# Altium project mb1045.PrjPCB
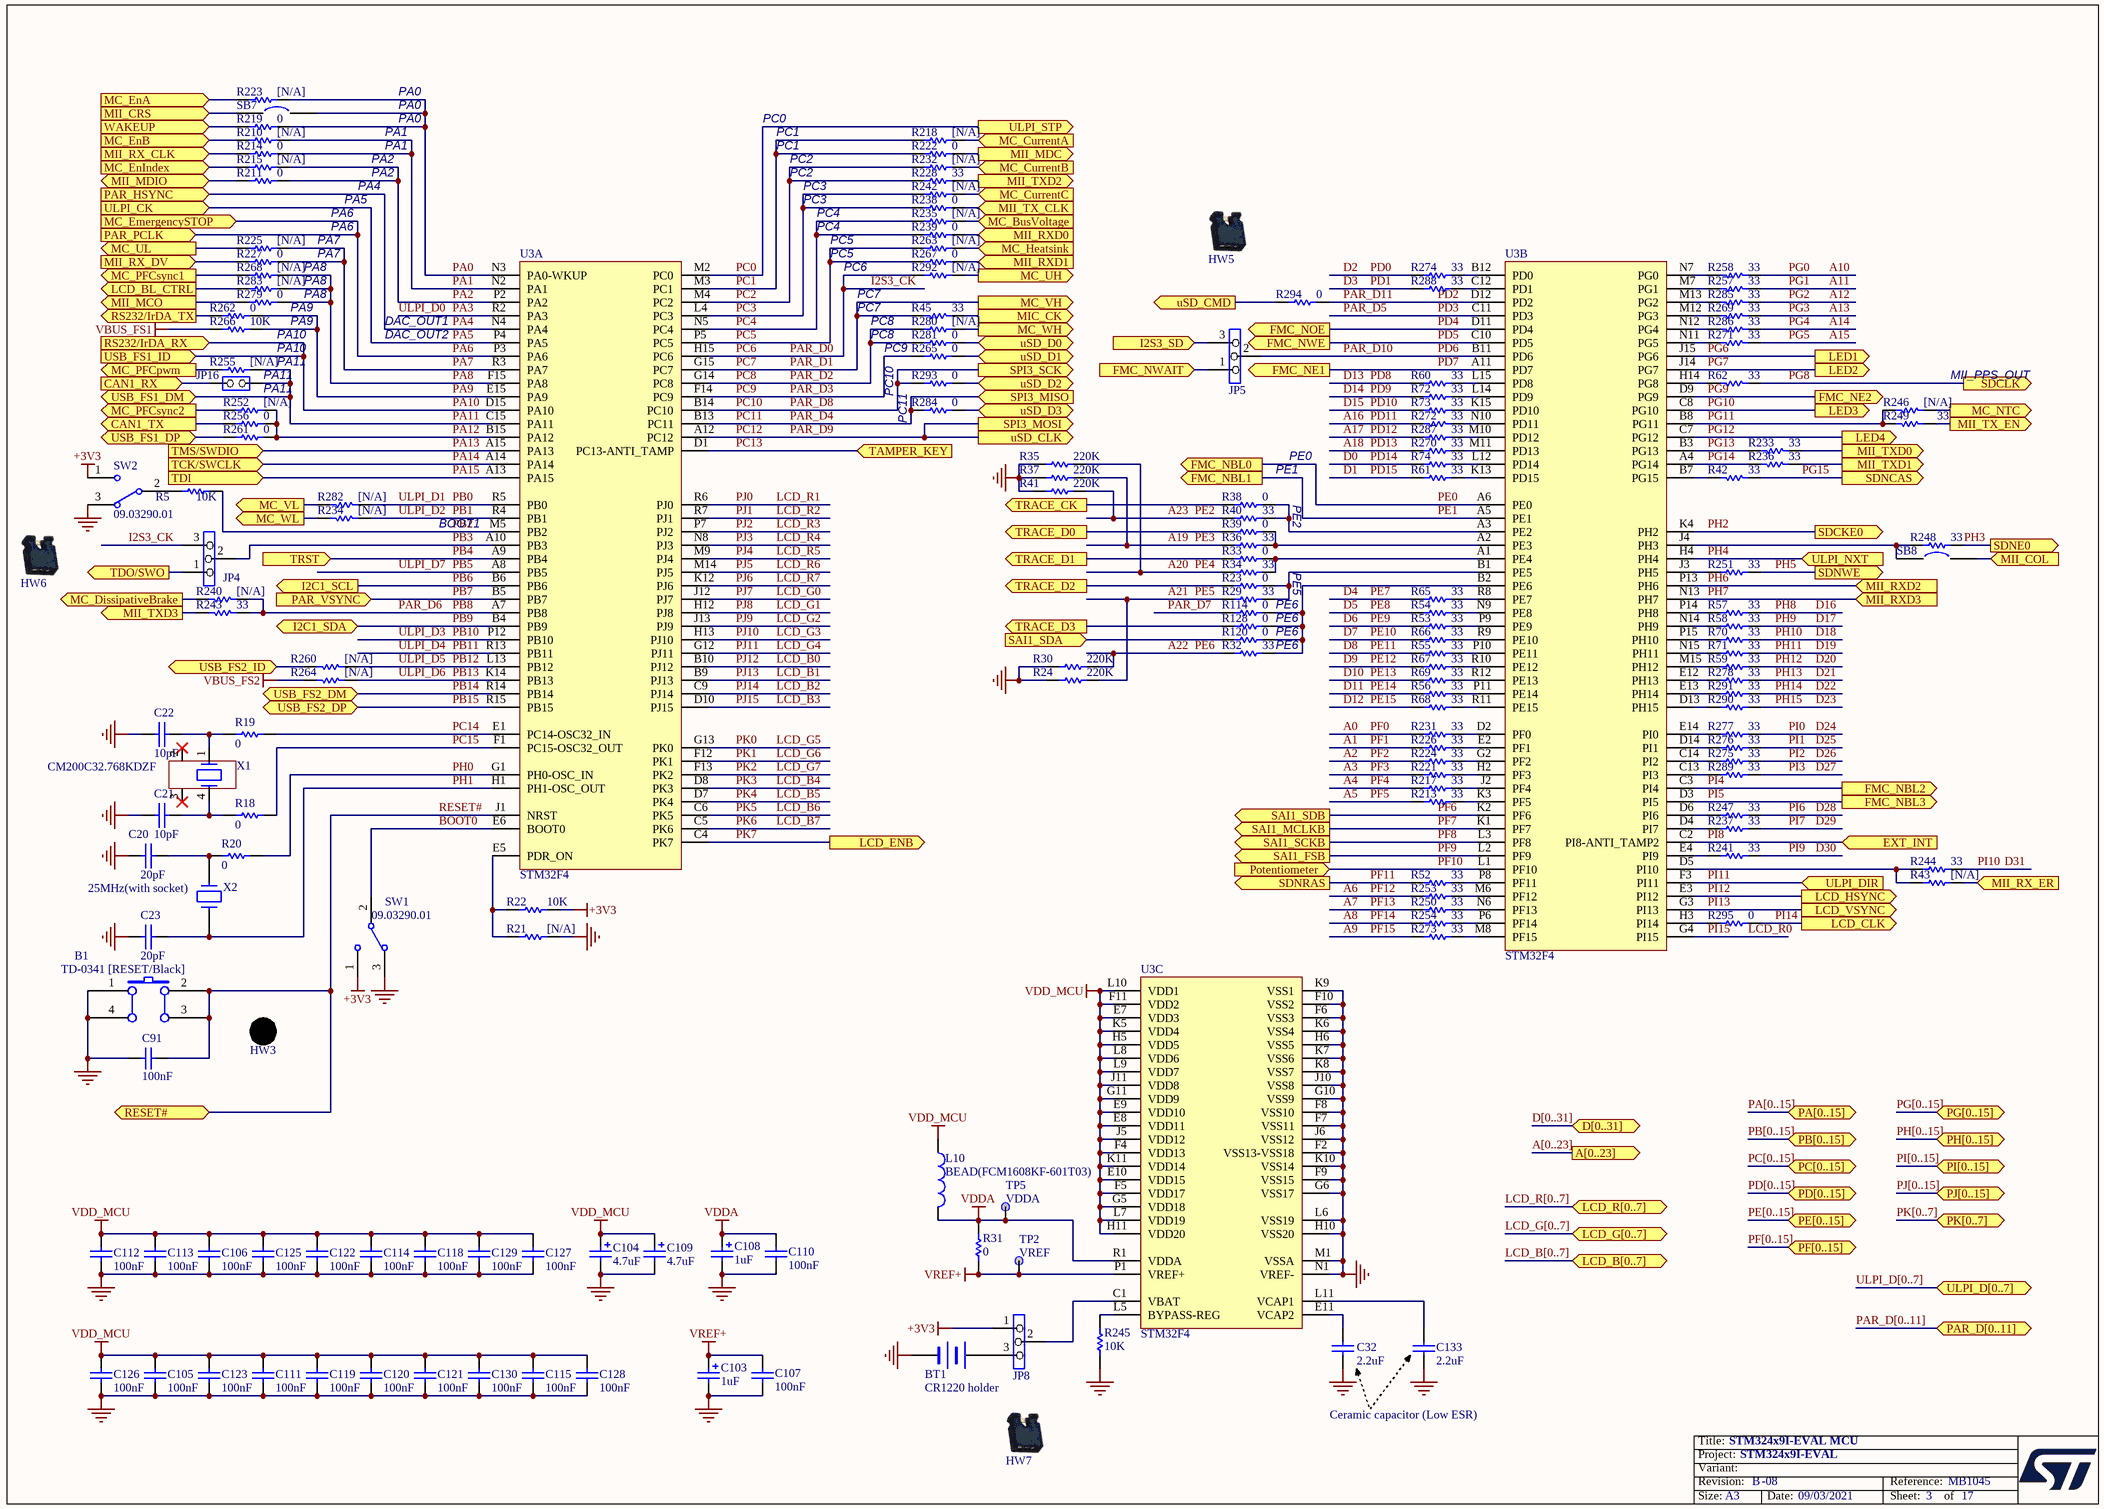
[diagram p0: MCU.SchDoc]
Board_Reference: MB1045; Board_PCB_Revision: B; Board_Name: STM324x9I-EVAL; Board_Document_Date: 09/03/2021; Board_Assembly_revision: 08
6 sheets, 346 parts. Net scope: flat (ports and power ports of the same name join across sheets).
Sheets:
  MCU.SchDoc
  Ethernet.SchDoc
  USB_OTG.SchDoc
  RS232&IrDA.SchDoc
  CAN&MicroSDD&IO_Expandor.SchDoc
  MotorControl.SchDoc

## Sheet MCU.SchDoc: STM324x9I-EVAL MCU
size A3; DocumentNumber: 3; Revision: B.3; SheetNumber: 3; SheetTotal: 17

### Parts
B1  TD-0341 [RESET/Black]  [PB10]
BT1  CR1220 holder  [BAT_2SM_CR1220]
C20  20pF  [0603C]
C21  10pF  [0603C]
C22  10pF  [0603C]
C23  20pF  [0603C]
C32  2.2uF  [1206C]
C91  100nF  [0603C]
C103  1uF  [TAN-A]
C104  4.7uF  [TAN-A]
C105  100nF  [0402C]
C106  100nF  [0402C]
C107  100nF  [0402C]
C108  1uF  [TAN-A]
C109  4.7uF  [TAN-A]
C110  100nF  [0402C]
C111  100nF  [0402C]
C112  100nF  [0402C]
C113  100nF  [0402C]
C114  100nF  [0402C]
C115  100nF  [0402C]
C118  100nF  [0402C]
C119  100nF  [0402C]
C120  100nF  [0402C]
C121  100nF  [0402C]
C122  100nF  [0402C]
C123  100nF  [0402C]
C125  100nF  [0402C]
C126  100nF  [0402C]
C127  100nF  [0402C]
C128  100nF  [0402C]
C129  100nF  [0402C]
C130  100nF  [0402C]
C133  2.2uF  [1206C]
HW3  BUTTON_HAT_BLACK  (value not drawn)  (mechanical)
HW5  JUMPER_OPEN  (value not drawn)
HW6  JUMPER_OPEN  (value not drawn)
HW7  JUMPER_OPEN  (value not drawn)
JP4  (no value)  [SIP3]
JP5  (no value)  [SIP3]
JP8  (no value)  [SIP3]
JP16  (no value)  [SIP2]
L10  BEAD(FCM1608KF-601T03)  [0603L]
R5  10K  [0603R]
R18  0  [0603R]
R19  0  [0603R]
R20  0  [0603R]
R21  [N/A]  [0603R]
R22  10K  [0603R]
R23  0  [0603R]
R24  220K  [0603R]
R29  33  [0402R]
R30  220K  [0603R]
R31  0  [0603R]
R32  33  [0402R]
R33  0  [0603R]
R34  33  [0402R]
R35  220K  [0603R]
R36  33  [0402R]
R37  220K  [0603R]
R38  0  [0603R]
R39  0  [0603R]
R40  33  [0402R]
R41  220K  [0603R]
R42  33  [0402R]
R43  [N/A]  [0603R]
R45  33  [0603R]
R52  33  [0402R]
R53  33  [0402R]
R54  33  [0402R]
R55  33  [0402R]
R56  33  [0402R]
R57  33  [0402R]
R58  33  [0402R]
R59  33  [0402R]
R60  33  [0402R]
R61  33  [0402R]
R62  33  [0402R]
R65  33  [0402R]
R66  33  [0402R]
R67  33  [0402R]
R68  33  [0402R]
R69  33  [0402R]
R70  33  [0402R]
R71  33  [0402R]
R72  33  [0402R]
R73  33  [0402R]
R74  33  [0402R]
R114  0  [0603R]
R120  0  [0603R]
R128  0  [0603R]
R210  [N/A]  [0603R]
R211  0  [0603R]
R213  33  [0402R]
R214  0  [0603R]
R215  [N/A]  [0603R]
R217  33  [0402R]
R218  [N/A]  [0603R]
R219  0  [0603R]
R221  33  [0402R]
R222  0  [0603R]
R223  [N/A]  [0603R]
R224  33  [0402R]
R225  [N/A]  [0603R]
R226  33  [0402R]
R227  0  [0603R]
R228  33  [0603R]
R231  33  [0402R]
R232  [N/A]  [0603R]
R233  33  [0603R]
R234  [N/A]  [0603R]
R235  [N/A]  [0603R]
R236  33  [0603R]
R237  33  [0402R]
R238  0  [0603R]
R239  0  [0603R]
R240  [N/A]  [0603R]
R241  33  [0402R]
R242  [N/A]  [0603R]
R243  33  [0603R]
R244  33  [0402R]
R245  10K  [0603R]
R246  [N/A]  [0603R]
R247  33  [0402R]
R248  33  [0402R]
R249  33  [0603R]
R250  33  [0402R]
R251  33  [0402R]
R252  [N/A]  [0603R]
R253  33  [0402R]
R254  33  [0402R]
R255  [N/A]  [0603R]
R256  0  [0603R]
R257  33  [0402R]
R258  33  [0402R]
R260  [N/A]  [0603R]
R261  0  [0603R]
R262  0  [0603R]
R263  [N/A]  [0603R]
R264  [N/A]  [0603R]
R265  0  [0603R]
R266  10K  [0603R]
R267  0  [0603R]
R268  [N/A]  [0603R]
R269  33  [0402R]
R270  33  [0402R]
R271  33  [0402R]
R272  33  [0402R]
R273  33  [0402R]
R274  33  [0402R]
R275  33  [0402R]
R276  33  [0402R]
R277  33  [0402R]
R278  33  [0402R]
R279  0  [0603R]
R280  [N/A]  [0603R]
R281  0  [0603R]
R282  [N/A]  [0603R]
R283  [N/A]  [0603R]
R284  0  [0603R]
R285  33  [0402R]
R286  33  [0402R]
R287  33  [0402R]
R288  33  [0402R]
R289  33  [0402R]
R290  33  [0402R]
R291  33  [0402R]
R292  [N/A]  [0603R]
R293  0  [0603R]
R294  0  [0603R]
R295  0  [0603R]
SB7  (no value)  [JP2_SMD]
SB8  (no value)  [JP2_SMD]
SW1  09.03290.01  [SW1_3TH_2R54_10X2R5]
SW2  09.03290.01  [SW1_3TH_2R54_10X2R5]
TP2  VREF  [TP]
TP5  VDDA  [TP]
U3  STM32F4  [BGA216_0R8_13X13_SKT]  (parts A,B,C of 3)
X1  CM200C32.768KDZF  [XTAL_4SM_8X3R8]
X2  25MHz(with socket)  [XTAL_socket]

### Ports
A[0..23] (out), CAN1_RX (in), CAN1_TX (out), D[0..31] (bidir), EXT_INT (in), FMC_NBL0 (out), FMC_NBL1 (out), FMC_NBL2 (out), FMC_NBL3 (out), FMC_NE1 (out), FMC_NE2 (out), FMC_NOE (out), FMC_NWAIT (in), FMC_NWE (out), I2C1_SCL (out), I2C1_SDA (bidir), I2S3_SD (in), LCD_B[0..7] (bidir), LCD_BL_CTRL (out), LCD_CLK (out), LCD_ENB (out), LCD_G[0..7] (bidir), LCD_HSYNC (out), LCD_R[0..7] (bidir), LCD_VSYNC (out), LED1 (out), LED2 (out), LED3 (out), LED4 (out), MC_BusVoltage (in), MC_CurrentA (in), MC_CurrentB (in), MC_CurrentC (in), MC_DissipativeBrake (out), MC_EmergencySTOP (in), MC_EnA (in), MC_EnB (in), MC_EnIndex (in), MC_Heatsink (in), MC_NTC (out), MC_PFCpwm (out), MC_PFCsync1 (out), MC_PFCsync2 (out), MC_UH (out), MC_UL (out), MC_VH (out), MC_VL (out), MC_WH (out), MC_WL (out), MIC_CK (out), MII_COL (in), MII_CRS (in), MII_MCO (out), MII_MDC (out), MII_MDIO (bidir), MII_RX_CLK (in), MII_RX_DV (in), MII_RX_ER (in), MII_RXD0 (in), MII_RXD1 (in), MII_RXD2 (in), MII_RXD3 (in), MII_TX_CLK (in), MII_TX_EN (out), MII_TXD0 (out), MII_TXD1 (out), MII_TXD2 (out), MII_TXD3 (out), PA[0..15] (bidir), PAR_D[0..11] (bidir), PAR_HSYNC (in), PAR_PCLK (in), PAR_VSYNC (in), PB[0..15] (bidir), PC[0..15] (bidir), PD[0..15] (bidir), PE[0..15] (bidir), PF[0..15] (bidir), PG[0..15] (bidir), PH[0..15] (bidir), PI[0..15] (bidir), PJ[0..15] (bidir), PK[0..7] (bidir), Potentiometer (in), RESET# (bidir), RS232/IrDA_RX (in), RS232/IrDA_TX (out), SAI1_FSB (out), SAI1_MCLKB (out), SAI1_SCKB (out), SAI1_SDA (in), SAI1_SDB (out), SDCKE0 (out), SDCLK (out), SDNCAS (out), SDNE0 (out), SDNRAS (out), SDNWE (out), SPI3_MISO (in), SPI3_MOSI (out), SPI3_SCK (out), TAMPER_KEY (in), TCK/SWCLK (in), TDI (in), TDO/SWO (out), TMS/SWDIO (in), TRACE_CK (out), TRACE_D0 (out), TRACE_D1 (out), TRACE_D2 (out), TRACE_D3 (out), TRST (in), ULPI_CK (in), ULPI_D[0..7] (bidir), ULPI_DIR (in), ULPI_NXT (in), ULPI_STP (out), USB_FS1_DM (bidir), USB_FS1_DP (bidir), USB_FS1_ID (in), USB_FS2_DM (bidir), USB_FS2_DP (bidir), USB_FS2_ID (bidir), uSD_CLK (out), uSD_CMD (out), uSD_D0 (bidir), uSD_D1 (bidir), uSD_D2 (bidir), uSD_D3 (bidir), WAKEUP (in)

### Nets
+3V3: JP8.1 R22.2 SW1.1 SW2.1
GND: B1.1(A0) B1.4(A1) BT1.2(-) C20.2 C21.2 C22.2 C23.2 C32.2 C91.1 C103.2 C104.2 C105.2 C106.2 C107.1 C108.2 C109.2 C110.1 C111.2 C112.2 C113.2 C114.2 C115.2 C118.2 C119.2 C120.2 C121.2 C122.2 C123.2 C125.2 C126.2 C127.2 C128.2 C129.2 C130.2 C133.2 R21.2 R24.1 R30.1 R35.1 R37.1 R41.1 R245.1 SW1.3 SW2.3 U3.F2(VSS13-VSS18) U3.F6(VSS3) U3.F7(VSS11) U3.F8(VSS10) U3.F9(VSS15) U3.F10(VSS2) U3.G6(VSS17) U3.G10(VSS9) U3.H6(VSS5) U3.H10(VSS20) U3.J6(VSS12) U3.J10(VSS8) U3.K6(VSS4) U3.K7(VSS6) U3.K8(VSS7) U3.K9(VSS1) U3.K10(VSS14) U3.L6(VSS19) U3.M1(VSSA) U3.N1(VREF-)
VBUS_FS1: R266.2
VBUS_FS2: R264.1
VDD_MCU: C104.1 C105.1 C106.1 C109.1 C111.1 C112.1 C113.1 C114.1 C115.1 C118.1 C119.1 C120.1 C121.1 C122.1 C123.1 C125.1 C126.1 C127.1 C128.1 C129.1 C130.1 L10.1 U3.E7(VDD3) U3.E8(VDD11) U3.E9(VDD10) U3.E10(VDD15) U3.F4(VDD13) U3.F5(VDD17) U3.F11(VDD2) U3.G5(VDD18) U3.G11(VDD9) U3.H5(VDD5) U3.H11(VDD20) U3.J5(VDD12) U3.J11(VDD8) U3.K5(VDD4) U3.K11(VDD14) U3.L7(VDD19) U3.L8(VDD6) U3.L9(VDD7) U3.L10(VDD1)
VDDA: C108.1 C110.2 L10.2 R31.1 TP5.1 U3.R1(VDDA)
VREF+: C103.1 C107.2 R31.2 TP2.1 U3.P1(VREF+)
A0: R231.2  [also labelled PF0]
A1: R226.2  [also labelled PF1]
A2: R224.2  [also labelled PF2]
A3: R221.2  [also labelled PF3]
A4: R217.2  [also labelled PF4]
A5: R213.2  [also labelled PF5]
A6: R253.2  [also labelled PF12]
A7: R250.2  [also labelled PF13]
A8: R254.2  [also labelled PF14]
A9: R273.2  [also labelled PF15]
A10: R258.2  [also labelled PG0]
A11: R257.2  [also labelled PG1]
A12: R285.2  [also labelled PG2]
A13: R269.2  [also labelled PG3]
A14: R286.2  [also labelled PG4]
A15: R271.2  [also labelled PG5]
A16: R272.1  [also labelled PD11]
A17: R287.2  [also labelled PD12]
A18: R270.2  [also labelled PD13]
A19: R36.2 R37.2  [also labelled PE3]
A20: R34.2 R35.2  [also labelled PE4]
A21: R24.2 R29.2  [also labelled PE5]
A22: R30.2 R32.2  [also labelled PE6]
A23: R40.2 R41.2  [also labelled PE2]
BOOT0: SW1.2 U3.E6(BOOT0)
D0: R74.2  [also labelled PD14]
D1: R61.2  [also labelled PD15]
D2: R274.2  [also labelled PD0]
D3: R288.2  [also labelled PD1]
D4: R65.2  [also labelled PE7]
D5: R54.2  [also labelled PE8]
D6: R53.2  [also labelled PE9]
D7: R66.2  [also labelled PE10]
D8: R55.2  [also labelled PE11]
D9: R67.2  [also labelled PE12]
D10: R69.2  [also labelled PE13]
D11: R56.2  [also labelled PE14]
D12: R68.2  [also labelled PE15]
D13: R60.2  [also labelled PD8]
D14: R72.2  [also labelled PD9]
D15: R73.2  [also labelled PD10]
D16: R57.1  [also labelled PH8]
D17: R58.1  [also labelled PH9]
D18: R70.1  [also labelled PH10]
D19: R71.1  [also labelled PH11]
D20: R59.1  [also labelled PH12]
D21: R278.1  [also labelled PH13]
D22: R291.1  [also labelled PH14]
D23: R290.1  [also labelled PH15]
D24: R277.1  [also labelled PI0]
D25: R276.1  [also labelled PI1]
D26: R275.1  [also labelled PI2]
D27: R289.1  [also labelled PI3]
D28: R247.1  [also labelled PI6]
D29: R237.1  [also labelled PI7]
D30: R241.1  [also labelled PI9]
D31: R244.1  [also labelled PI10]
I2S3_CK: JP4.3 R292.2 U3.H15(PC6)  [also labelled PAR_D0, PC6]
LCD_B0: U3.B10(PJ12)  [also labelled PJ12]
LCD_B1: U3.B9(PJ13)  [also labelled PJ13]
LCD_B2: U3.C9(PJ14)  [also labelled PJ14]
LCD_B3: U3.D10(PJ15)  [also labelled PJ15]
LCD_B4: U3.D8(PK3)  [also labelled PK3]
LCD_B5: U3.D7(PK4)  [also labelled PK4]
LCD_B6: U3.C6(PK5)  [also labelled PK5]
LCD_B7: U3.C5(PK6)  [also labelled PK6]
LCD_G0: U3.J12(PJ7)  [also labelled PJ7]
LCD_G1: U3.H12(PJ8)  [also labelled PJ8]
LCD_G2: U3.J13(PJ9)  [also labelled PJ9]
LCD_G3: U3.H13(PJ10)  [also labelled PJ10]
LCD_G4: U3.G12(PJ11)  [also labelled PJ11]
LCD_G5: U3.G13(PK0)  [also labelled PK0]
LCD_G6: U3.F12(PK1)  [also labelled PK1]
LCD_G7: U3.F13(PK2)  [also labelled PK2]
LCD_R0: U3.G4(PI15)  [also labelled PI15]
LCD_R1: U3.R6(PJ0)  [also labelled PJ0]
LCD_R2: U3.R7(PJ1)  [also labelled PJ1]
LCD_R3: U3.P7(PJ2)  [also labelled PJ2]
LCD_R4: U3.N8(PJ3)  [also labelled PJ3]
LCD_R5: U3.M9(PJ4)  [also labelled PJ4]
LCD_R6: U3.M14(PJ5)  [also labelled PJ5]
LCD_R7: U3.K12(PJ6)  [also labelled PJ6]
PA0: R219.1 R223.1 SB7.2 U3.N3(PA0-WKUP)
PA1: R210.1 R214.1 U3.N2(PA1)
PA2: R211.1 R215.1 U3.P2(PA2)
PA3: U3.R2(PA3)  [also labelled ULPI_D0]
PA4: U3.N4(PA4) ; port PAR_HSYNC
PA5: U3.P4(PA5) ; port ULPI_CK
PA6: U3.P3(PA6) ; port MC_EmergencySTOP, port PAR_PCLK
PA7: R225.1 R227.1 U3.R3(PA7)
PA8: R268.1 R279.1 R283.1 U3.F15(PA8)
PA9: R262.1 R266.1 U3.E15(PA9)
PA10: U3.D15(PA10) ; port RS232/IrDA_RX, port USB_FS1_ID
PA11: JP16.1(COMMON) R255.1 U3.C15(PA11) ; port USB_FS1_DM
PA12: R252.1 R256.1 R261.1 U3.B15(PA12)
PA13: U3.A15(PA13) ; port TMS/SWDIO
PA14: U3.A14(PA14) ; port TCK/SWCLK
PA15: U3.A13(PA15) ; port TDI
PAR_D1: R45.1 U3.G15(PC7) ; port MC_VH  [also labelled PC7]
PAR_D2: R280.2 R281.2 U3.G14(PC8)  [also labelled PC8]
PAR_D3: R265.2 U3.F14(PC9)  [also labelled PC9]
PAR_D4: R284.2 U3.B13(PC11) ; port SPI3_MISO  [also labelled PC11]
PAR_D5: U3.C11(PD3)  [also labelled PD3]
PAR_D6: R240.2 R243.2 U3.A7(PB8)  [also labelled PB8]
PAR_D7: R114.1
PAR_D8: R293.2 U3.B14(PC10) ; port SPI3_SCK  [also labelled PC10]
PAR_D9: U3.A12(PC12) ; port uSD_CLK, port SPI3_MOSI  [also labelled PC12]
PAR_D10: JP5.2 U3.B11(PD6)  [also labelled PD6]
PAR_D11: R294.2 U3.D12(PD2)  [also labelled PD2]
PB0: R282.2 U3.R5(PB0)  [also labelled ULPI_D1]
PB1: R234.2 U3.R4(PB1)  [also labelled ULPI_D2]
PB2: R5.2 U3.M5(PB2)
PB3: JP4.2 U3.A10(PB3)
PB4: U3.A9(PB4) ; port TRST
PB5: U3.A8(PB5)  [also labelled ULPI_D7]
PB6: U3.B6(PB6) ; port I2C1_SCL
PB7: U3.B5(PB7) ; port PAR_VSYNC
PB9: U3.B4(PB9) ; port I2C1_SDA
PB10: U3.P12(PB10)  [also labelled ULPI_D3]
PB11: U3.R13(PB11)  [also labelled ULPI_D4]
PB12: R260.2 U3.L13(PB12)  [also labelled ULPI_D5]
PB13: R264.2 U3.K14(PB13)  [also labelled ULPI_D6]
PB14: U3.R14(PB14) ; port USB_FS2_DM
PB15: U3.R15(PB15) ; port USB_FS2_DP
PC0: U3.M2(PC0) ; port ULPI_STP
PC1: R218.2 R222.2 U3.M3(PC1)
PC2: R228.2 R232.2 U3.M4(PC2)
PC3: R238.2 R242.2 U3.L4(PC3)
PC4: R235.2 R239.2 U3.N5(PC4)
PC5: R263.2 R267.2 U3.P5(PC5)
PC13: U3.D1(PC13-ANTI_TAMP) ; port TAMPER_KEY
PC14: R19.2 U3.E1(PC14-OSC32_IN)
PC15: R18.2 U3.F1(PC15-OSC32_OUT)
PD4: U3.D11(PD4) ; port FMC_NOE
PD5: U3.C10(PD5) ; port FMC_NWE
PD7: U3.A11(PD7) ; port FMC_NE1
PE0: U3.A6(PE0) ; port FMC_NBL0
PE1: U3.A5(PE1) ; port FMC_NBL1
PF6: U3.K2(PF6) ; port SAI1_SDB
PF7: U3.K1(PF7) ; port SAI1_MCLKB
PF8: U3.L3(PF8) ; port SAI1_SCKB
PF9: U3.L2(PF9) ; port SAI1_FSB
PF10: U3.L1(PF10) ; port Potentiometer
PF11: R52.2 ; port SDNRAS
PG6: U3.J15(PG6) ; port LED1
PG7: U3.J14(PG7) ; port LED2
PG8: R62.2 ; port SDCLK
PG9: U3.D9(PG9) ; port FMC_NE2
PG10: U3.C8(PG10) ; port LED3
PG11: R246.1 R249.1 U3.B8(PG11)
PG12: U3.C7(PG12) ; port LED4
PG13: R233.1 U3.B3(PG13)
PG14: R236.1 U3.A4(PG14)
PG15: R42.2 ; port SDNCAS
PH0: R20.1 U3.G1(PH0-OSC_IN)
PH1: C23.1 U3.H1(PH1-OSC_OUT) X2.1
PH2: U3.K4(PH2) ; port SDCKE0
PH3: R248.1 ; port SDNE0
PH4: U3.H4(PH4) ; port ULPI_NXT
PH5: R251.1 ; port SDNWE
PH6: U3.P13(PH6) ; port MII_RXD2
PH7: U3.N13(PH7) ; port MII_RXD3
PI4: U3.C3(PI4) ; port FMC_NBL2
PI5: U3.D3(PI5) ; port FMC_NBL3
PI8: U3.C2(PI8-ANTI_TAMP2) ; port EXT_INT
PI11: U3.F3(PI11) ; port ULPI_DIR
PI12: U3.E3(PI12) ; port LCD_HSYNC
PI13: U3.G3(PI13) ; port LCD_VSYNC
PI14: R295.1 ; port LCD_CLK
PK7: U3.C4(PK7) ; port LCD_ENB
RESET#: B1.2(B0) B1.3(B1) C91.2 U3.J1(NRST) ; port RESET#
NetBT1_1: BT1.1(+) JP8.3
NetC6_2: R223.2 ; port MC_EnA
NetC7_2: R252.2 ; port MC_PFCsync2
NetC8_2: R210.2 ; port MC_EnB
NetC9_2: R215.2 ; port MC_EnIndex
NetC10_2: R255.2 ; port MC_PFCpwm
NetC11_1: R263.1 ; port MC_Heatsink
NetC12_2: R242.1 ; port MC_CurrentC
NetC13_2: R232.1 ; port MC_CurrentB
NetC14_2: R218.1 ; port MC_CurrentA
NetC15_1: R235.1 ; port MC_BusVoltage
NetC18_2: R268.2 ; port MC_PFCsync1
NetC20_1: C20.1 R20.2 X2.2
NetC21_1: C21.1 R18.1 X1.4
NetC22_1: C22.1 R19.1 X1.1
NetC32_1: C32.1 U3.E11(VCAP2)
NetC133_1: C133.1 U3.L11(VCAP1)
NetCN1_3: R292.1 ; port MC_UH
NetCN1_5: R225.2 ; port MC_UL
NetCN1_9: R282.1 ; port MC_VL
NetCN1_11: R280.1 ; port MC_WH
NetCN1_13: R234.1 ; port MC_WL
NetCN1_21: R246.2 ; port MC_NTC
NetCN1_23: R240.1 ; port MC_DissipativeBrake
NetCN15_4: R260.1 ; port USB_FS2_ID
NetCN17_1: R293.1 ; port uSD_D2
NetCN17_2: R284.1 ; port uSD_D3
NetCN17_3: R294.1 ; port uSD_CMD
NetCN17_7: R281.1 ; port uSD_D0
NetCN17_8: R265.1 ; port uSD_D1
NetJP4_1: JP4.1 ; port TDO/SWO
NetJP5_1: JP5.1 ; port FMC_NWAIT
NetJP5_3: JP5.3 ; port I2S3_SD
NetJP6_3: R279.2 ; port MII_MCO
NetJP8_2: JP8.2 U3.C1(VBAT)
NetJP16_2: JP16.2(NO) ; port CAN1_RX
NetR5_1: R5.1 SW2.2
NetR21_1: R21.1 R22.1 U3.E5(PDR_ON)
NetR23_1: R23.1 ; port TRACE_D2
NetR23_2: R23.2 R29.1 U3.B1(PE5)
NetR32_1: R32.1 R114.2 R120.1 R128.2 U3.B2(PE6)
NetR33_1: R33.1 ; port TRACE_D1
NetR33_2: R33.2 R34.1 U3.A1(PE4)
NetR36_1: R36.1 R39.2 U3.A2(PE3)
NetR38_1: R38.1 ; port TRACE_CK
NetR38_2: R38.2 R40.1 U3.A3(PE2)
NetR39_1: R39.1 ; port TRACE_D0
NetR42_1: R42.1 U3.B7(PG15)
NetR43_1: R43.1 ; port MII_RX_ER
NetR43_2: R43.2 R244.2 U3.D5(PI10)
NetR45_2: R45.2 ; port MIC_CK
NetR48_2: R267.1 ; port MII_RXD1
NetR49_2: R239.1 ; port MII_RXD0
NetR50_2: R227.2 ; port MII_RX_DV
NetR51_2: R214.2 ; port MII_RX_CLK
NetR52_1: R52.1 U3.P8(PF11)
NetR53_1: R53.1 U3.P9(PE9)
NetR54_1: R54.1 U3.N9(PE8)
NetR55_1: R55.1 U3.P10(PE11)
NetR56_1: R56.1 U3.P11(PE14)
NetR57_2: R57.2 U3.P14(PH8)
NetR58_2: R58.2 U3.N14(PH9)
NetR59_2: R59.2 U3.M15(PH12)
NetR60_1: R60.1 U3.L15(PD8)
NetR61_1: R61.1 U3.K13(PD15)
NetR62_1: R62.1 U3.H14(PG8)
NetR63_2: R238.1 ; port MII_TX_CLK
NetR65_1: R65.1 U3.R8(PE7)
NetR66_1: R66.1 U3.R9(PE10)
NetR67_1: R67.1 U3.R10(PE12)
NetR68_1: R68.1 U3.R11(PE15)
NetR69_1: R69.1 U3.R12(PE13)
NetR70_2: R70.2 U3.P15(PH10)
NetR71_2: R71.2 U3.N15(PH11)
NetR72_1: R72.1 U3.L14(PD9)
NetR73_1: R73.1 U3.K15(PD10)
NetR74_1: R74.1 U3.L12(PD14)
NetR75_1: R211.2 ; port MII_MDIO
NetR120_2: R120.2 ; port SAI1_SDA
NetR128_1: R128.1 ; port TRACE_D3
NetR213_1: R213.1 U3.K3(PF5)
NetR217_1: R217.1 U3.J2(PF4)
NetR219_2: R219.2 ; port WAKEUP
NetR221_1: R221.1 U3.H2(PF3)
NetR222_1: R222.1 ; port MII_MDC
NetR224_1: R224.1 U3.G2(PF2)
NetR226_1: R226.1 U3.E2(PF1)
NetR228_1: R228.1 ; port MII_TXD2
NetR231_1: R231.1 U3.D2(PF0)
NetR233_2: R233.2 ; port MII_TXD0
NetR236_2: R236.2 ; port MII_TXD1
NetR237_2: R237.2 U3.D4(PI7)
NetR241_2: R241.2 U3.E4(PI9)
NetR243_1: R243.1 ; port MII_TXD3
NetR245_2: R245.2 U3.L5(BYPASS-REG)
NetR247_2: R247.2 U3.D6(PI6)
NetR248_2: R248.2 SB8.1 U3.J4(PH3)
NetR249_2: R249.2 ; port MII_TX_EN
NetR250_1: R250.1 U3.N6(PF13)
NetR251_2: R251.2 U3.J3(PH5)
NetR253_1: R253.1 U3.M6(PF12)
NetR254_1: R254.1 U3.P6(PF14)
NetR256_2: R256.2 ; port CAN1_TX
NetR257_1: R257.1 U3.M7(PG1)
NetR258_1: R258.1 U3.N7(PG0)
NetR261_2: R261.2 ; port USB_FS1_DP
NetR262_2: R262.2 ; port RS232/IrDA_TX
NetR269_1: R269.1 U3.M12(PG3)
NetR270_1: R270.1 U3.M11(PD13)
NetR271_1: R271.1 U3.N11(PG5)
NetR272_2: R272.2 U3.N10(PD11)
NetR273_1: R273.1 U3.M8(PF15)
NetR274_1: R274.1 U3.B12(PD0)
NetR275_2: R275.2 U3.C14(PI2)
NetR276_2: R276.2 U3.D14(PI1)
NetR277_2: R277.2 U3.E14(PI0)
NetR278_2: R278.2 U3.E12(PH13)
NetR283_2: R283.2 ; port LCD_BL_CTRL
NetR285_1: R285.1 U3.M13(PG2)
NetR286_1: R286.1 U3.N12(PG4)
NetR287_1: R287.1 U3.M10(PD12)
NetR288_1: R288.1 U3.C12(PD1)
NetR289_2: R289.2 U3.C13(PI3)
NetR290_2: R290.2 U3.D13(PH15)
NetR291_2: R291.2 U3.E13(PH14)
NetR295_2: R295.2 U3.H3(PI14)
NetSB7_1: SB7.1 ; port MII_CRS
NetSB8_2: SB8.2 ; port MII_COL

Not connected (* = marked no-connect by the designer): X1 2* 3*

### Buses and harness runs
bus A[0..23] = port A[0..23]
bus D[0..31] = port D[0..31]
bus LCD_B[0..7] = port LCD_B[0..7]
bus LCD_G[0..7] = port LCD_G[0..7]
bus LCD_R[0..7] = port LCD_R[0..7]
bus PA[0..15] = port PA[0..15]
bus PAR_D[0..11] = port PAR_D[0..11]
bus PB[0..15] = port PB[0..15]
bus PC[0..15] = port PC[0..15]
bus PD[0..15] = port PD[0..15]
bus PE[0..15] = port PE[0..15]
bus PF[0..15] = port PF[0..15]
bus PG[0..15] = port PG[0..15]
bus PH[0..15] = port PH[0..15]
bus PI[0..15] = port PI[0..15]
bus PJ[0..15] = port PJ[0..15]
bus PK[0..7] = port PK[0..7]
bus ULPI_D[0..7] = port ULPI_D[0..7]

### Notes on the sheet
- PA0
- PA2
- PA1
- PC0
- PC1
- PC2
- PA7
- PA6
- PA5
- PA4
- PC3
- PC4
- PC5
- PA9
- PA8
- PC6
- PC7
- PA11
- PA10
- DAC_OUT1
- DAC_OUT2
- PC8
- PC9
- MII_PPS_OUT
- PC10
- PC11
- PE1
- PE0
- PE2
- BOOT1
- PE5
- PE6
- Ceramic capacitor (Low ESR)
- Title:
- Project:
- Size:
- Revision:
- Variant:
- A3
- -
- Date:
- Reference:
- Sheet:
- of

### Library data of the parts
B1 = SW PUSHBUTTON: SE PUSHBUTTON
BT1 = BATTERY
C20-C23 C105 C106 C111-C115 C118-C123 C125-C130 = CAP: Capacitor
  C105 C106 C111-C115 C118-C123 C125-C130: Published: 8-Jun-2000; Revision: July-2002: Re-released for DXP Platform.; Publisher: Altium Limited; Value: 100nF
C32 C107 C110 C133 = Cap: Capacitor; Value: 10nF; Published: 8-Jun-2000; Revision: July-2002: Re-released for DXP Platform.; Publisher: Altium Limited
C91 = CAP: Capacitor; Value: 100pF; Published: 8-Jun-2000; Revision: July-2002: Re-released for DXP Platform.; Publisher: Altium Limited
C103 C108 = Cap Pol1: Polarized Capacitor (Radial); Value: 10uF; Published: 8-Jun-2000; Revision: July-2002: Re-released for DXP Platform.; Publisher: Altium Limited
C104 C109 = Cap Pol1: Polarized Capacitor (Radial); Value: 47uF; Published: 8-Jun-2000; Revision: July-2002: Re-released for DXP Platform.; Publisher: Altium Limited
JP4 JP5 JP8 = Jumper3
JP16 = JP2
L10 = Inductor: Value: 100uH; Published: 8-Jun-2000; Revision: July-2002: Re-released for DXP Platform.; Publisher: Altium Limited
R5 R18-R23 R29 R31-R34 R36 R38-R40 R42 R43 R45 R52-R62 R65-R74 R114 R120 R128 R210 R211 R213-R215 R217-R219 R221-R228 R231-R258 R260-R265 R267-R295 = Res1: Resistor; Value: 1K; Published: 8-Jun-2000; Revision: July-2002: Re-released for DXP Platform.; Publisher: Altium Limited
R24 R30 R35 R37 R41 R266 = res1: Resistor; Value: 1K; Published: 8-Jun-2000; Revision: July-2002: Re-released for DXP Platform.; Publisher: Altium Limited
SB7 SB8 = Circuit Breaker: Published: 24-Mar-1999; Revision: July-2002: Re-released for DXP Platform.; Publisher: Altium Limited
SW1 SW2 = SW-SPDT: SPDT Subminiature Toggle Switch, Right Angle Mounting, Vertical Actuation; Revision 1: Jul-2002: Re-released for DXP Platform.; Revision 2: 17-Dec-2003: Schematic revised, PCB Footprint replaced.; Published: 24-Mar-1999; Datasheet: Latest Revision: 05-Dec-2000; Publisher: Altium Limited
TP2 TP5 = TP
U3 = Big_Manta_TFBGA216
X1 = MC306
X2 = CRYSTAL

## Sheet Ethernet.SchDoc: STM324x9I-EVAL Ethernet
size A4; DocumentNumber: 8; Revision: B.3; SheetNumber: 8; SheetTotal: 17
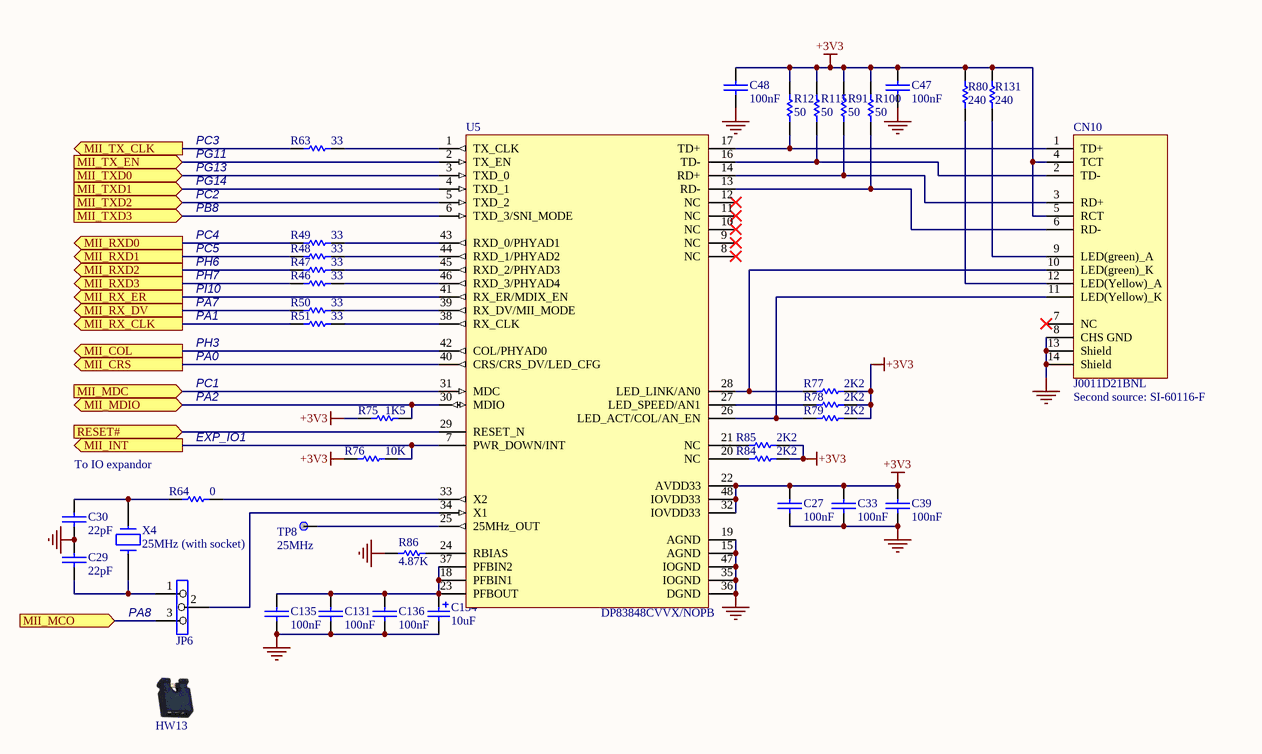
[diagram p1: Ethernet.SchDoc]

### Parts
C27  100nF  [0603C]
C29  22pF  [0603C]
C30  22pF  [0603C]
C33  100nF  [0603C]
C39  100nF  [0603C]
C47  100nF  [0603C]
C48  100nF  [0603C]
C131  100nF  [0603C]
C134  10uF  [TAN-A]
C135  100nF  [0603C]
C136  100nF  [0603C]
CN10  J0011D21BNL  [RJ45_J0011D01BNL]
HW13  JUMPER_OPEN  (value not drawn)
JP6  (no value)  [SIP3]
R46  33  [0603R]
R47  33  [0603R]
R48  33  [0603R]
R49  33  [0603R]
R50  33  [0603R]
R51  33  [0603R]
R63  33  [0603R]
R64  0  [0603R]
R75  1K5  [0603R]
R76  10K  [0603R]
R77  2K2  [0603R]
R78  2K2  [0603R]
R79  2K2  [0603R]
R80  240  [0603R]
R84  2K2  [0603R]
R85  2K2  [0603R]
R86  4.87K  [0603R]
R91  50  [0603R]
R100  50  [0603R]
R115  50  [0603R]
R121  50  [0603R]
R131  240  [0603R]
TP8  25MHz  [TP]
U5  DP83848CVVX/NOPB  [LQFP48_0R5_9X9]
X4  25MHz (with socket)  [XTAL_socket]

### Ports
MII_COL (out), MII_CRS (out), MII_INT (out), MII_MCO (in), MII_MDC (in), MII_MDIO (bidir), MII_RX_CLK (out), MII_RX_DV (out), MII_RX_ER (out), MII_RXD0 (out), MII_RXD1 (out), MII_RXD2 (out), MII_RXD3 (out), MII_TX_CLK (out), MII_TX_EN (in), MII_TXD0 (in), MII_TXD1 (in), MII_TXD2 (in), MII_TXD3 (in), RESET# (in)

### Nets
+3V3: C27.1 C33.2 C39.2 C47.2 C48.2 CN10.4(TCT) CN10.5(RCT) R75.2 R76.1 R77.2 R78.2 R79.2 R80.2 R84.2 R85.2 R91.1 R100.1 R115.1 R121.1 R131.2 U5.22(AVDD33) U5.32(IOVDD33) U5.48(IOVDD33)
GND: C27.2 C29.2 C30.1 C33.1 C39.1 C47.1 C48.1 C131.1 C134.2 C135.2 C136.1 CN10.8(CHS_GND) CN10.13(Shield) CN10.14(Shield) R86.1 U5.15(AGND) U5.19(AGND) U5.35(IOGND) U5.36(DGND) U5.47(IOGND)
PH6: R47.2 ; port MII_RXD2
PH7: R46.2 ; port MII_RXD3
RESET#: U5.29(RESET_N) ; port RESET#
NetC29_1: C29.1 JP6.1 X4.1
NetC30_2: C30.2 R64.2 X4.2
NetC131_2: C131.2 C134.1 C135.1 C136.2 U5.18(PFBIN1) U5.23(PFBOUT) U5.37(PFBIN2)
NetCN10_1: CN10.1(TD+) R121.2 U5.17(TD+)
NetCN10_2: CN10.2(TD-) R115.2 U5.16(TD-)
NetCN10_3: CN10.3(RD+) R91.2 U5.14(RD+)
NetCN10_6: CN10.6(RD-) R100.2 U5.13(RD-)
NetCN10_9: CN10.9(LED(green)_A) R131.1
NetCN10_10: CN10.10(LED(green)_K) R77.1 U5.28(LED_LINK/AN0)
NetCN10_11: CN10.11(LED(Yellow)_K) R79.1 U5.26(LED_ACT/COL/AN_EN)
NetCN10_12: CN10.12(LED(Yellow)_A) R80.1
NetJP6_2: JP6.2 U5.34(X1)
NetJP6_3: JP6.3 ; port MII_MCO
NetR43_1: U5.41(RX_ER/MDIX_EN) ; port MII_RX_ER
NetR46_1: R46.1 U5.46(RXD_3/PHYAD4)
NetR47_1: R47.1 U5.45(RXD_2/PHYAD3)
NetR48_1: R48.1 U5.44(RXD_1/PHYAD2)
NetR48_2: R48.2 ; port MII_RXD1
NetR49_1: R49.1 U5.43(RXD_0/PHYAD1)
NetR49_2: R49.2 ; port MII_RXD0
NetR50_1: R50.1 U5.39(RX_DV/MII_MODE)
NetR50_2: R50.2 ; port MII_RX_DV
NetR51_1: R51.1 U5.38(RX_CLK)
NetR51_2: R51.2 ; port MII_RX_CLK
NetR63_1: R63.1 U5.1(TX_CLK)
NetR63_2: R63.2 ; port MII_TX_CLK
NetR64_1: R64.1 U5.33(X2)
NetR75_1: R75.1 U5.30(MDIO) ; port MII_MDIO
NetR76_2: R76.2 U5.7(PWR_DOWN/INT) ; port MII_INT
NetR78_1: R78.1 U5.27(LED_SPEED/AN1)
NetR84_1: R84.1 U5.20(NC)
NetR85_1: R85.1 U5.21(NC)
NetR86_2: R86.2 U5.24(RBIAS)
NetR222_1: U5.31(MDC) ; port MII_MDC
NetR228_1: U5.5(TXD_2) ; port MII_TXD2
NetR233_2: U5.3(TXD_0) ; port MII_TXD0
NetR236_2: U5.4(TXD_1) ; port MII_TXD1
NetR243_1: U5.6(TXD_3/SNI_MODE) ; port MII_TXD3
NetR249_2: U5.2(TX_EN) ; port MII_TX_EN
NetSB7_1: U5.40(CRS/CRS_DV/LED_CFG) ; port MII_CRS
NetSB8_2: U5.42(COL/PHYAD0) ; port MII_COL
NetTP8_1: TP8.1 U5.25(25MHz_OUT)

Not connected (* = marked no-connect by the designer): CN10 7(NC)*; U5 8(NC)* 9(NC)* 10(NC)* 11(NC)* 12(NC)*

### Notes on the sheet
- PC3
- PG11
- PG13
- PG14
- PC2
- PB8
- PC4
- PC5
- PH6
- PH7
- PI10
- PA7
- PH3
- PA1
- PA0
- PC1
- PA2
- (near CN10) Second source: SI-60116-F
- To IO expandor
- EXP_IO1
- (near JP6) PA8
- Title:
- Project:
- Size:
- Revision:
- Variant:
- A4
- -
- Date:
- Reference:
- Sheet:
- of

### Library data of the parts
C27 C29 C30 C33 C39 C47 C48 C131 C135 C136 = CAP: Capacitor
C134 = Cap Pol1: Polarized Capacitor (Radial); Published: 8-Jun-2000; Revision: July-2002: Re-released for DXP Platform.; Publisher: Altium Limited; Value: 10uF
CN10 = J0011D21B: RJ45_connector, 8 pins, 1.27mm, RA, TH, Height 17.13mm
JP6 = Jumper3
R46-R51 R63 R64 R75-R80 R84-R86 R91 R100 R115 R121 R131 = Res1: Resistor; Value: 1K; Published: 8-Jun-2000; Revision: July-2002: Re-released for DXP Platform.; Publisher: Altium Limited
TP8 = TP
U5 = DP83848CVV: Transceiver, DP83848C/I/VYB/YB PHYTER™ QFP Single Port 10/100 Mb/s Ethernet Physical Layer Transceiver
X4 = CRYSTAL

## Sheet USB_OTG.SchDoc: STM324x9I-EVAL USB_OTG_HS
size A4; DocumentNumber: 9; Revision: B.3; SheetNumber: 9; SheetTotal: 17
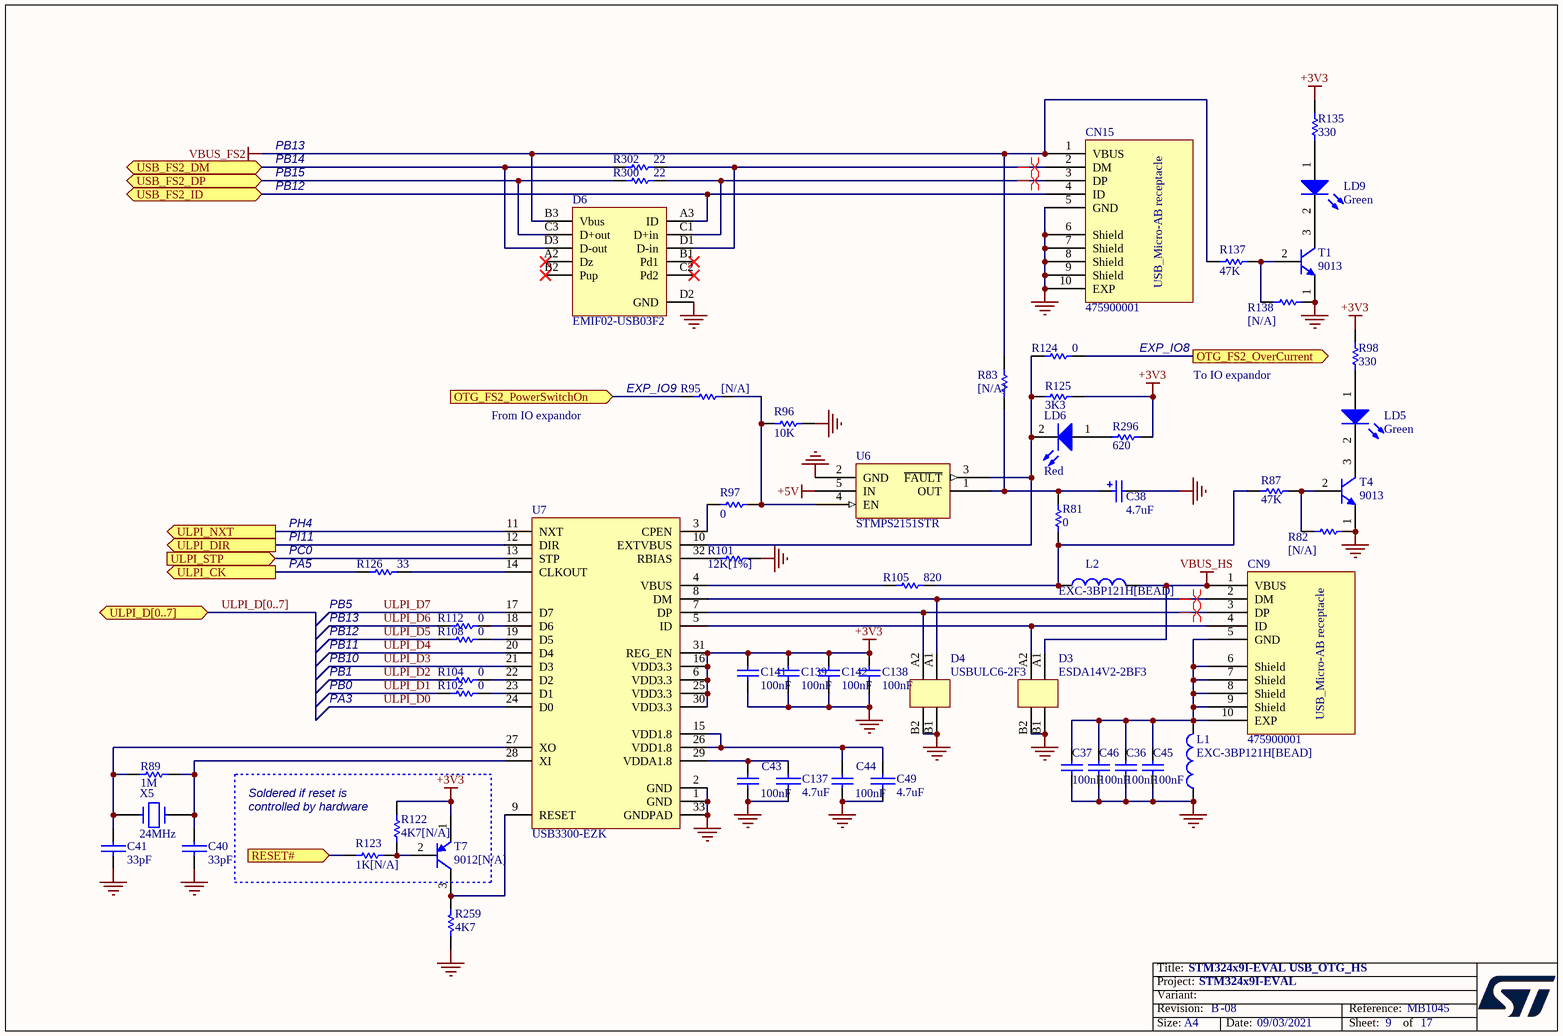
[diagram p2: USB_OTG.SchDoc]

### Parts
C36  100nF  [0603C]
C37  100nF  [0603C]
C38  4.7uF  [TAN-A]
C40  33pF  [0603C]
C41  33pF  [0603C]
C43  100nF  [0603C]
C44  100nF  [0603C]
C45  100nF  [0603C]
C46  100nF  [0603C]
C49  4.7uF  [TAN-A]
C137  4.7uF  [TAN-A]
C138  100nF  [0603C]
C139  100nF  [0603C]
C141  100nF  [0603C]
C142  100nF  [0603C]
CN9  475900001  [MOLEX_47590001]
CN15  475900001  [MOLEX_47590001]
D3  ESDA14V2-2BF3  [BGA4_0R4_0R8X0R8]
D4  USBULC6-2F3  [BGA4_0R4_1X1]
D6  EMIF02-USB03F2  [BGA11_0R5_1R57X2R07]
L1  EXC-3BP121H[BEAD]  [0603L]
L2  EXC-3BP121H[BEAD]  [0603L]
LD5  Green  [0603D]
LD6  Red  [0603D]
LD9  Green  [0603D]
R81  0  [0603R]
R82  [N/A]  [0603R]
R83  [N/A]  [0603R]
R87  47K  [0603R]
R89  1M  [0603R]
R95  [N/A]  [0603R]
R96  10K  [0603R]
R97  0  [0603R]
R98  330  [0603R]
R101  12K[1%]  [0603R]
R102  0  [0603R]
R104  0  [0603R]
R105  820  [0603R]
R108  0  [0603R]
R112  0  [0603R]
R122  4K7[N/A]  [0603R]
R123  1K[N/A]  [0603R]
R124  0  [0603R]
R125  3K3  [0603R]
R126  33  [0603R]
R135  330  [0603R]
R137  47K  [0603R]
R138  [N/A]  [0603R]
R259  4K7  [0603R]
R296  620  [0603R]
R300  22  [0603R]
R302  22  [0603R]
T1  9013  [SOT23-213]
T4  9013  [SOT23-213]
T7  9012[N/A]  [SOT23-213]
U6  STMPS2151STR  [SOT23-5]
U7  USB3300-EZK  [QFN32_0R5_5X5]
X5  24MHz  [XTAL1]

### Ports
OTG_FS2_OverCurrent (out), OTG_FS2_PowerSwitchOn (in), RESET# (in), ULPI_CK (out), ULPI_D[0..7] (bidir), ULPI_DIR (out), ULPI_NXT (out), ULPI_STP (in), USB_FS2_DM (bidir), USB_FS2_DP (bidir), USB_FS2_ID (bidir)

### Nets
+3V3: C138.1 C139.1 C141.1 C142.1 R98.2 R122.1 R125.1 R135.2 R296.2 T7.1(E) U7.6(VDD3.3) U7.16(VDD3.3) U7.25(VDD3.3) U7.30(VDD3.3) U7.31(REG_EN)
+5V: U6.5(IN)
GND: C36.2 C37.2 C38.2 C40.2 C41.2 C43.2 C44.2 C45.2 C46.2 C49.2 C137.2 C138.2 C139.2 C141.2 C142.2 CN15.5(GND) CN15.6(Shield) CN15.7(Shield) CN15.8(Shield) CN15.9(Shield) CN15.10(EXP) D3.B1 D3.B2 D4.B1 D4.B2 D6.D2(GND) L1.1 R82.1 R96.1 R101.1 R138.1 R259.1 T1.1(E) T4.1(E) U6.2(GND) U7.1(GND) U7.2(GND) U7.33(GNDPAD)
VBUS_FS2: CN15.1(VBUS) D6.B3(Vbus) R83.1 R137.1
VBUS_HS: CN9.1(VBUS) D3.A1 L2.2
PA5: R126.2 ; port ULPI_CK
PB14: D6.D3(D-out) R302.2 ; port USB_FS2_DM
PB15: D6.C3(D+out) R300.2 ; port USB_FS2_DP
PC0: U7.13(STP) ; port ULPI_STP
PH4: U7.11(NXT) ; port ULPI_NXT
PI11: U7.12(DIR) ; port ULPI_DIR
RESET#: R123.2 ; port RESET#
ULPI_D0: U7.24(D0)  [project net PA3]
ULPI_D1: R102.2  [project net PB0]
ULPI_D2: R104.2  [project net PB1]
ULPI_D3: U7.21(D3)  [project net PB10]
ULPI_D4: U7.20(D4)  [project net PB11]
ULPI_D5: R108.2  [project net PB12]
ULPI_D6: R112.2  [project net PB13]
ULPI_D7: U7.17(D7)  [project net PB5]
NetC36_1: C36.1 C37.1 C45.1 C46.1 CN9.5(GND) CN9.6(Shield) CN9.7(Shield) CN9.8(Shield) CN9.9(Shield) CN9.10(EXP) L1.2
NetC38_1: C38.1 R81.1 R83.2 U6.1(OUT)
NetC40_1: C40.1 R89.2 U7.28(XI) X5.1
NetC41_1: C41.1 R89.1 U7.27(XO) X5.2
NetC43_1: C43.1 C137.1 U7.29(VDDA1.8)
NetC44_1: C44.1 C49.1 U7.15(VDD1.8) U7.26(VDD1.8)
NetCN9_2: CN9.2(DM) D4.A1 U7.8(DM)
NetCN9_3: CN9.3(DP) D4.A2 U7.7(DP)
NetCN9_4: CN9.4(ID) D3.A2 U7.5(ID)
NetCN15_2: CN15.2(DM) D6.D1(D-in) R302.1
NetCN15_3: CN15.3(DP) D6.C1(D+in) R300.1
NetCN15_4: CN15.4(ID) D6.A3(ID) ; port USB_FS2_ID
NetL2_1: L2.1 R81.2 R87.2 R105.2
NetLD5_1: LD5.1(A) R98.1
NetLD5_2: LD5.2(K) T4.3(C)
NetLD6_1: LD6.1(A) R296.1
NetLD6_2: LD6.2(K) R124.2 R125.2 U6.3(~{FAULT}) U7.10(EXTVBUS)
NetLD9_1: LD9.1(A) R135.1
NetLD9_2: LD9.2(K) T1.3(C)
NetR82_2: R82.2 R87.1 T4.2(B)
NetR95_1: R95.1 R96.2 R97.2 U6.4(EN)
NetR95_2: R95.2 ; port OTG_FS2_PowerSwitchOn
NetR97_1: R97.1 U7.3(CPEN)
NetR101_2: R101.2 U7.32(RBIAS)
NetR102_1: R102.1 U7.23(D1)
NetR104_1: R104.1 U7.22(D2)
NetR105_1: R105.1 U7.4(VBUS)
NetR108_1: R108.1 U7.19(D5)
NetR112_1: R112.1 U7.18(D6)
NetR122_2: R122.2 R123.1 T7.2(B)
NetR124_1: R124.1 ; port OTG_FS2_OverCurrent
NetR126_1: R126.1 U7.14(CLKOUT)
NetR137_2: R137.2 R138.2 T1.2(B)
NetR259_2: R259.2 T7.3(C) U7.9(RESET)

Not connected (* = marked no-connect by the designer): D6 A2(Dz)* B1(Pd1)* B2(Pup)* C2(Pd2)*

### Buses and harness runs
bus ULPI_D[0..7] = port ULPI_D[0..7]

### Layout directives
differential pair: NetCN9_2, NetCN9_3, NetCN15_2, NetCN15_3

### Notes on the sheet
- PB13
- PB14
- PB15
- PB12
- EXP_IO8
- To IO expandor
- From IO expandor
- (near R95) EXP_IO9
- PH4
- PI11
- PC0
- PA5
- PB11
- (near R126) PB13
- (near R126) PB5
- PA3
- PB0
- PB1
- PB10
- (near R122) Soldered if reset is
- (near R122) controlled by hardware
- Title:
- Project:
- Size:
- Revision:
- Variant:
- A4
- -
- Date:
- Reference:
- Sheet:
- of
- (in symbol 475900001) USB_Micro-AB receptacle

### Library data of the parts
C36 C37 C43-C46 C138 C139 C141 C142 = Cap: Capacitor; Value: 10nF; Published: 8-Jun-2000; Revision: July-2002: Re-released for DXP Platform.; Publisher: Altium Limited
C38 = Cap Pol1: as C104 on sheet MCU; Published: 8-Jun-2000; Revision: July-2002: Re-released for DXP Platform.; Publisher: Altium Limited
C40 C41 C49 C137 = CAP: Capacitor
L1 L2 = Inductor: Value: 100uH; Published: 8-Jun-2000; Revision: July-2002: Re-released for DXP Platform.; Publisher: Altium Limited
LD5 LD6 LD9 = LED2: Typical RED, GREEN, YELLOW, AMBER GaAs LED; Published: 8-Jun-2000; Revision: July-2002: Re-released for DXP Platform.; Publisher: Altium Limited
R81 R83 R89 R95 R97 R101 R102 R104 R108 R112 R122-R124 R126 R259 R296 R300 R302 = Res1: Resistor; Value: 1K; Published: 8-Jun-2000; Revision: July-2002: Re-released for DXP Platform.; Publisher: Altium Limited
R82 R87 R96 R98 R105 R125 R135 R137 R138 = res1: Resistor; Value: 1K; Published: 8-Jun-2000; Revision: July-2002: Re-released for DXP Platform.; Publisher: Altium Limited
T1 T4 = NPN: NPN Bipolar Transistor; Code - JEDEC: TO-226-AA; Published: 8-Jun-2000; Revision: July-2002: Re-released for DXP Platform.; Publisher: Altium Limited
T7 = PNP: PNP Bipolar Transistor; Code - JEDEC: SOT-23; Published: 8-Jun-2000; Revision: July-2002: Re-released for DXP Platform.; Publisher: Altium Limited
U6 = STMPS2141STR
X5 = CRYSTAL

## Sheet RS232&IrDA.SchDoc: STM324x9I-EVAL RS232&IrDA
size A4; DocumentNumber: 11; Revision: B.3; SheetNumber: 11; SheetTotal: 17
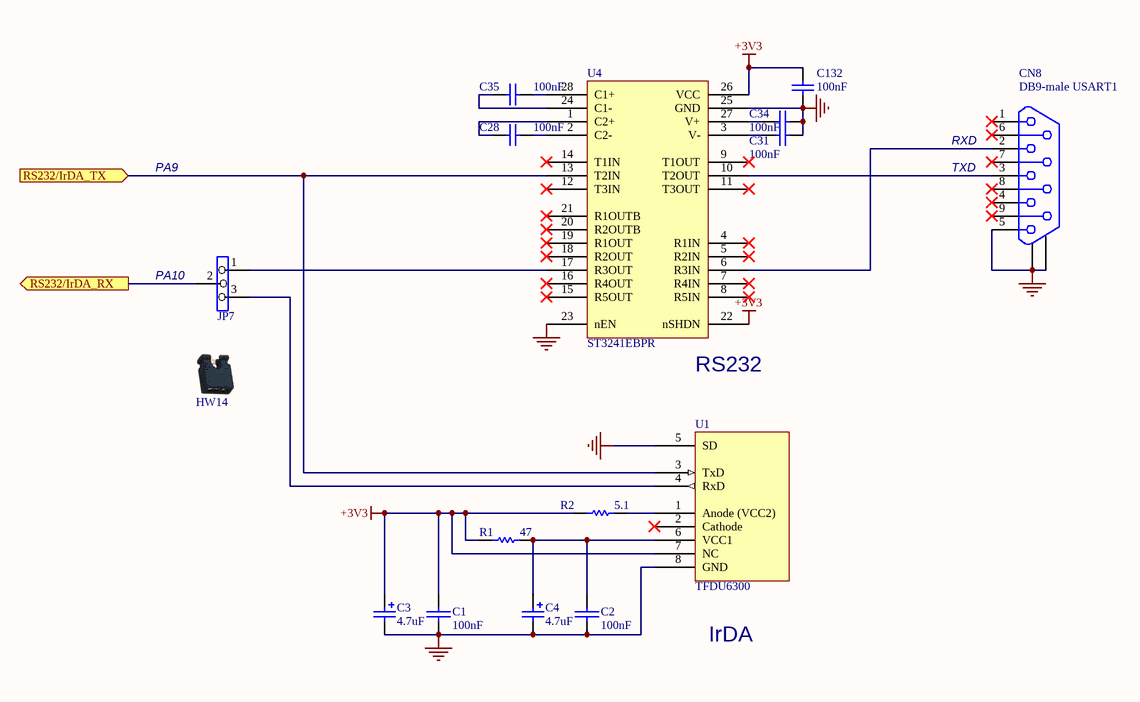
[diagram p3: RS232&IrDA.SchDoc]

### Parts
C1  100nF  [0603C]
C2  100nF  [0603C]
C3  4.7uF  [TAN-A]
C4  4.7uF  [TAN-A]
C28  100nF  [0603C]
C31  100nF  [0603C]
C34  100nF  [0603C]
C35  100nF  [0603C]
C132  100nF  [0603C]
CN8  DB9-male USART1  [DB9/M]
HW14  JUMPER_OPEN  (value not drawn)
JP7  (no value)  [SIP3]
R1  47  [0603R]
R2  5.1  [0603R]
U1  TFDU6300  [IR_VISHAY3]
U4  ST3241EBPR  [SSOP28_0R65_10R2X7R8]

### Ports
RS232/IrDA_RX (out), RS232/IrDA_TX (in)

### Nets
+3V3: C1.1 C3.1 C132.1 R1.1 R2.1 U1.7(NC) U4.22(nSHDN) U4.26(VCC)
GND: C1.2 C2.2 C3.2 C4.2 C31.1 C34.1 C132.2 CN8.5 CN8.10 CN8.11 U1.5(SD) U1.8(GND) U4.23(nEN) U4.25(GND)
PA10: JP7.2 ; port RS232/IrDA_RX
NetC2_1: C2.1 C4.1 R1.2 U1.6(VCC1)
NetC28_1: C28.1 U4.1(C2+)
NetC28_2: C28.2 U4.2(C2-)
NetC31_2: C31.2 U4.3(V-)
NetC34_2: C34.2 U4.27(V+)
NetC35_1: C35.1 U4.24(C1-)
NetC35_2: C35.2 U4.28(C1+)
NetCN8_2: CN8.2 U4.6(R3IN)
NetCN8_3: CN8.3 U4.10(T2OUT)
NetJP7_1: JP7.1 U4.17(R3OUT)
NetJP7_3: JP7.3 U1.4(RxD)
NetR2_2: R2.2 U1.1(Anode_(VCC2))
NetR262_2: U1.3(TxD) U4.13(T2IN) ; port RS232/IrDA_TX

Not connected (* = marked no-connect by the designer): CN8 1* 4* 6* 7* 8* 9*; U1 2(Cathode)*; U4 4(R1IN)* 5(R2IN)* 7(R4IN)* 8(R5IN)* 9(T1OUT)* 11(T3OUT)* 12(T3IN)* 14(T1IN)* 15(R5OUT)* 16(R4OUT)* 18(R2OUT)* 19(R1OUT)* 20(R2OUTB)* 21(R1OUTB)*

### Notes on the sheet
- PA9
- (near CN8) RXD
- (near CN8) TXD
- (near JP7) PA10
- (near U4) RS232
- IrDA
- Title:
- Project:
- Size:
- Revision:
- Variant:
- A4
- -
- Date:
- Reference:
- Sheet:
- of

### Library data of the parts
C1 C2 = CAP: Capacitor
C3 C4 = Cap Pol1: Polarized Capacitor (Radial); Value: 100pF; Published: 8-Jun-2000; Revision: July-2002: Re-released for DXP Platform.; Publisher: Altium Limited
C28 C31 C34 C35 C132 = Cap: Capacitor; Value: 10nF; Published: 8-Jun-2000; Revision: July-2002: Re-released for DXP Platform.; Publisher: Altium Limited
CN8 = DB9-USART
JP7 = Jumper3
R1 R2 = Res1: Resistor; Value: 1K; Published: 8-Jun-2000; Revision: July-2002: Re-released for DXP Platform.; Publisher: Altium Limited
U1 = TFDU4300
U4 = ST3241

## Sheet CAN&MicroSDD&IO_Expandor.SchDoc: STM324x9I-EVAL CAN&uSD&IO_Expandor
size A4; DocumentNumber: 12; Revision: B.3; SheetNumber: 12; SheetTotal: 17
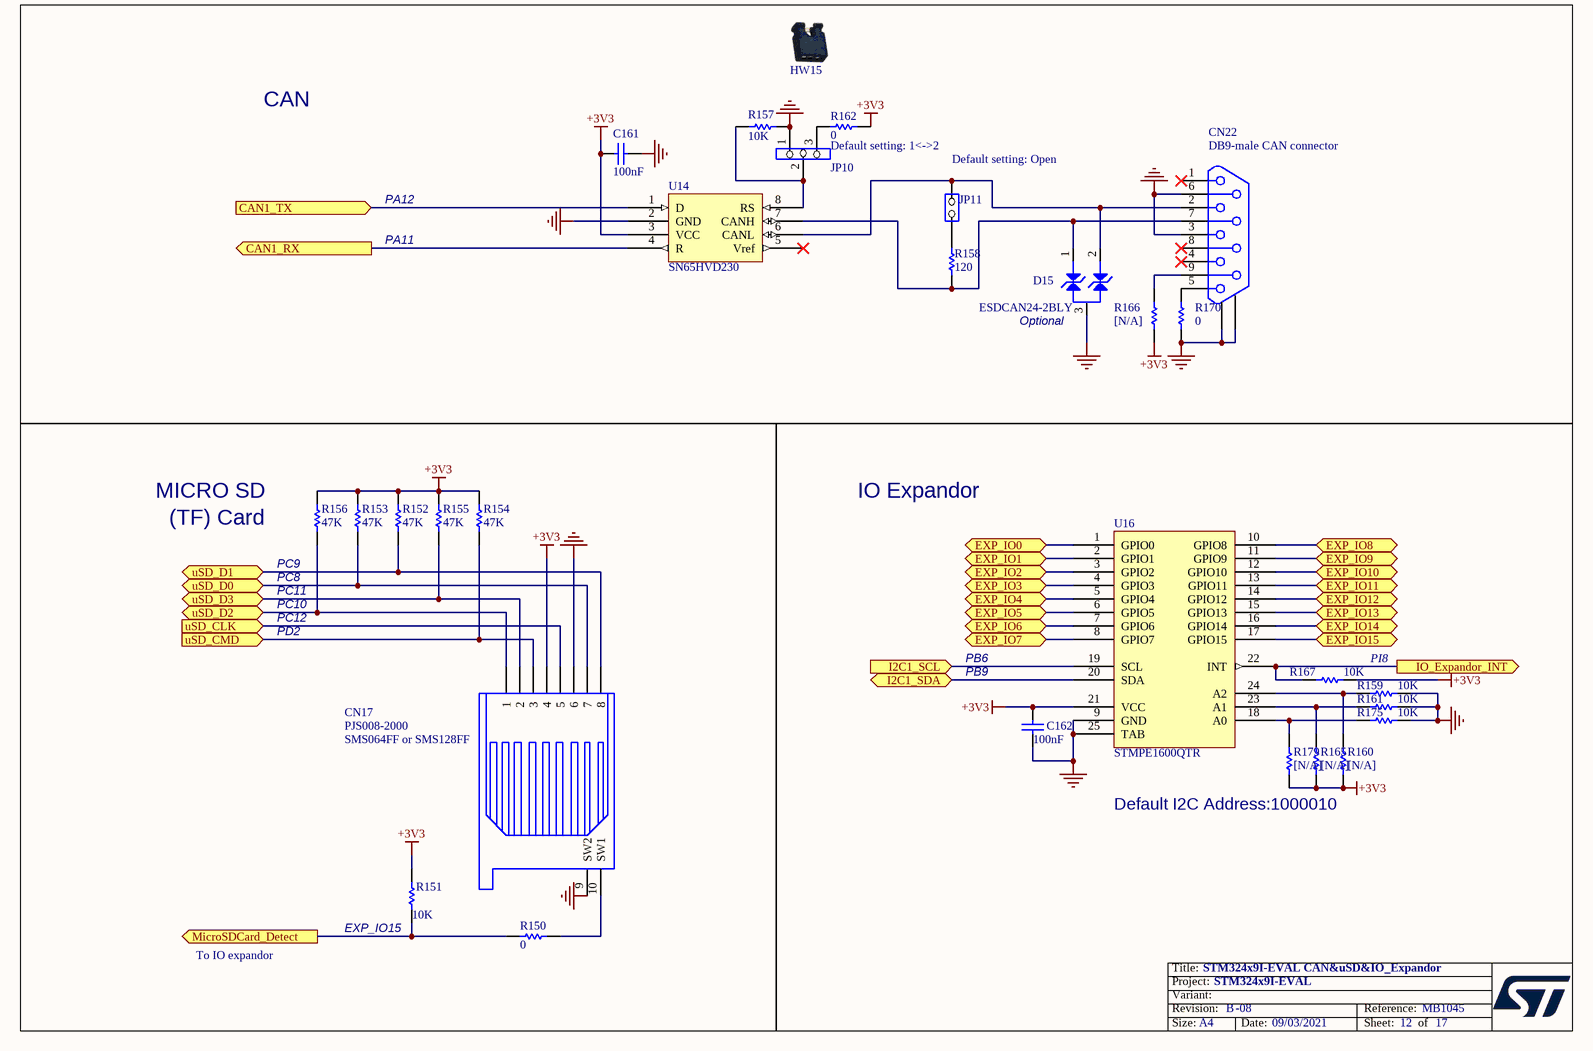
[diagram p4: CAN&MicroSDD&IO_Expandor.SchDoc]

### Parts
C161  100nF  [0603C]
C162  100nF  [0603C]
CN17  PJS008-2000  [MSD_PJS008_]
CN22  DB9-male CAN connector  [DB9/M]
D15  ESDCAN24-2BLY  [SOT23-213]
HW15  JUMPER_OPEN  (value not drawn)
JP10  (no value)  [SIP3]
JP11  (no value)  [SIP2]
R150  0  [0603R]
R151  10K  [0603R]
R152  47K  [0603R]
R153  47K  [0603R]
R154  47K  [0603R]
R155  47K  [0603R]
R156  47K  [0603R]
R157  10K  [0603R]
R158  120  [0603R]
R159  10K  [0603R]
R160  [N/A]  [0603R]
R161  10K  [0603R]
R162  0  [0603R]
R165  [N/A]  [0603R]
R166  [N/A]  [0603R]
R167  10K  [0603R]
R170  0  [0603R]
R175  10K  [0603R]
R179  [N/A]  [0603R]
U14  SN65HVD230  [SOIC8_1R27_4R9X6]
U16  STMPE1600QTR  [QFN24_0R5_4X4]

### Ports
CAN1_RX (out), CAN1_TX (in), EXP_IO0 (bidir), EXP_IO1 (bidir), EXP_IO2 (bidir), EXP_IO3 (bidir), EXP_IO4 (bidir), EXP_IO5 (bidir), EXP_IO6 (bidir), EXP_IO7 (bidir), EXP_IO8 (bidir), EXP_IO9 (bidir), EXP_IO10 (bidir), EXP_IO11 (bidir), EXP_IO12 (bidir), EXP_IO13 (bidir), EXP_IO14 (bidir), EXP_IO15 (bidir), I2C1_SCL (in), I2C1_SDA (bidir), IO_Expandor_INT (out), MicroSDCard_Detect (out), uSD_CLK (in), uSD_CMD (in), uSD_D0 (bidir), uSD_D1 (bidir), uSD_D2 (bidir), uSD_D3 (bidir)

### Nets
+3V3: C161.1 C162.1 CN17.4 R151.2 R152.1 R153.1 R154.1 R155.1 R156.1 R160.1 R162.2 R165.1 R166.1 R167.1 R179.1 U14.3(VCC) U16.21(VCC)
GND: C161.2 C162.2 CN17.6 CN17.9(SW2) CN22.3 CN22.6 CN22.10 CN22.11 D15.3 JP10.1 R157.2 R159.1 R161.1 R170.1 R175.1 U14.2(GND) U16.9(GND) U16.25(TAB)
PAR_D9: CN17.5 ; port uSD_CLK
PB6: U16.19(SCL) ; port I2C1_SCL
PB9: U16.20(SDA) ; port I2C1_SDA
NetCN17_1: CN17.1 R156.2 ; port uSD_D2
NetCN17_2: CN17.2 R155.2 ; port uSD_D3
NetCN17_3: CN17.3 R154.2 ; port uSD_CMD
NetCN17_7: CN17.7 R153.2 ; port uSD_D0
NetCN17_8: CN17.8 R152.2 ; port uSD_D1
NetCN17_10: CN17.10(SW1) R150.2
NetCN22_2: CN22.2 D15.2 JP11.2(NO) U14.6(CANL)
NetCN22_5: CN22.5 R170.2
NetCN22_7: CN22.7 D15.1 R158.1 U14.7(CANH)
NetCN22_9: CN22.9 R166.2
NetJP10_2: JP10.2 R157.1 U14.8(RS)
NetJP10_3: JP10.3 R162.1
NetJP11_1: JP11.1(COMMON) R158.2
NetJP16_2: U14.4(R) ; port CAN1_RX
NetR150_1: R150.1 R151.1 ; port MicroSDCard_Detect
NetR159_2: R159.2 R160.2 U16.24(A2)
NetR161_2: R161.2 R165.2 U16.23(A1)
NetR167_2: R167.2 U16.22(INT) ; port IO_Expandor_INT
NetR175_2: R175.2 R179.2 U16.18(A0)
NetR256_2: U14.1(D) ; port CAN1_TX
NetU16_1: U16.1(GPIO0) ; port EXP_IO0
NetU16_2: U16.2(GPIO1) ; port EXP_IO1
NetU16_3: U16.3(GPIO2) ; port EXP_IO2
NetU16_4: U16.4(GPIO3) ; port EXP_IO3
NetU16_5: U16.5(GPIO4) ; port EXP_IO4
NetU16_6: U16.6(GPIO5) ; port EXP_IO5
NetU16_7: U16.7(GPIO6) ; port EXP_IO6
NetU16_8: U16.8(GPIO7) ; port EXP_IO7
NetU16_10: U16.10(GPIO8) ; port EXP_IO8
NetU16_11: U16.11(GPIO9) ; port EXP_IO9
NetU16_12: U16.12(GPIO10) ; port EXP_IO10
NetU16_13: U16.13(GPIO11) ; port EXP_IO11
NetU16_14: U16.14(GPIO12) ; port EXP_IO12
NetU16_15: U16.15(GPIO13) ; port EXP_IO13
NetU16_16: U16.16(GPIO14) ; port EXP_IO14
NetU16_17: U16.17(GPIO15) ; port EXP_IO15

Not connected (* = marked no-connect by the designer): CN22 1* 4* 8*; U14 5(Vref)*

### Notes on the sheet
- CAN
- Default setting: 1<->2
- (near JP11) Default setting: Open
- PA12
- PA11
- (near D15) Optional
- MICRO SD
- IO Expandor
- (near R156) (TF) Card
- (near R156) PC8
- (near R156) PC9
- PC10
- PC11
- PC12
- PD2
- PB9
- PB6
- PI8
- (near CN17) SMS064FF or SMS128FF
- Default I2C Address:1000010
- To IO expandor
- (near R151) EXP_IO15
- Title:
- Project:
- Size:
- Revision:
- Variant:
- A4
- -
- Date:
- Reference:
- Sheet:
- of

### Library data of the parts
C161 C162 = Cap: Capacitor; Value: 10nF; Published: 8-Jun-2000; Revision: July-2002: Re-released for DXP Platform.; Publisher: Altium Limited
CN17 = SMS016AFA5E
CN22 = DB9-CAN
JP10 = Jumper3
JP11 = JP2
R150 R151 R157 R160 R165 R167 R179 = Res1: Resistor; Value: 1K; Published: 8-Jun-2000; Revision: July-2002: Re-released for DXP Platform.; Publisher: Altium Limited
R152-R156 R158 R159 R161 R162 R166 R170 R175 = res1: Resistor; Value: 1K; Published: 8-Jun-2000; Revision: July-2002: Re-released for DXP Platform.; Publisher: Altium Limited
U14 = SN65HVD230D
U16 = STMPE1600

## Sheet MotorControl.SchDoc: STM324x9I-EVAL Motor control
size A4; DocumentNumber: 14; Revision: B.3; SheetNumber: 14; SheetTotal: 17
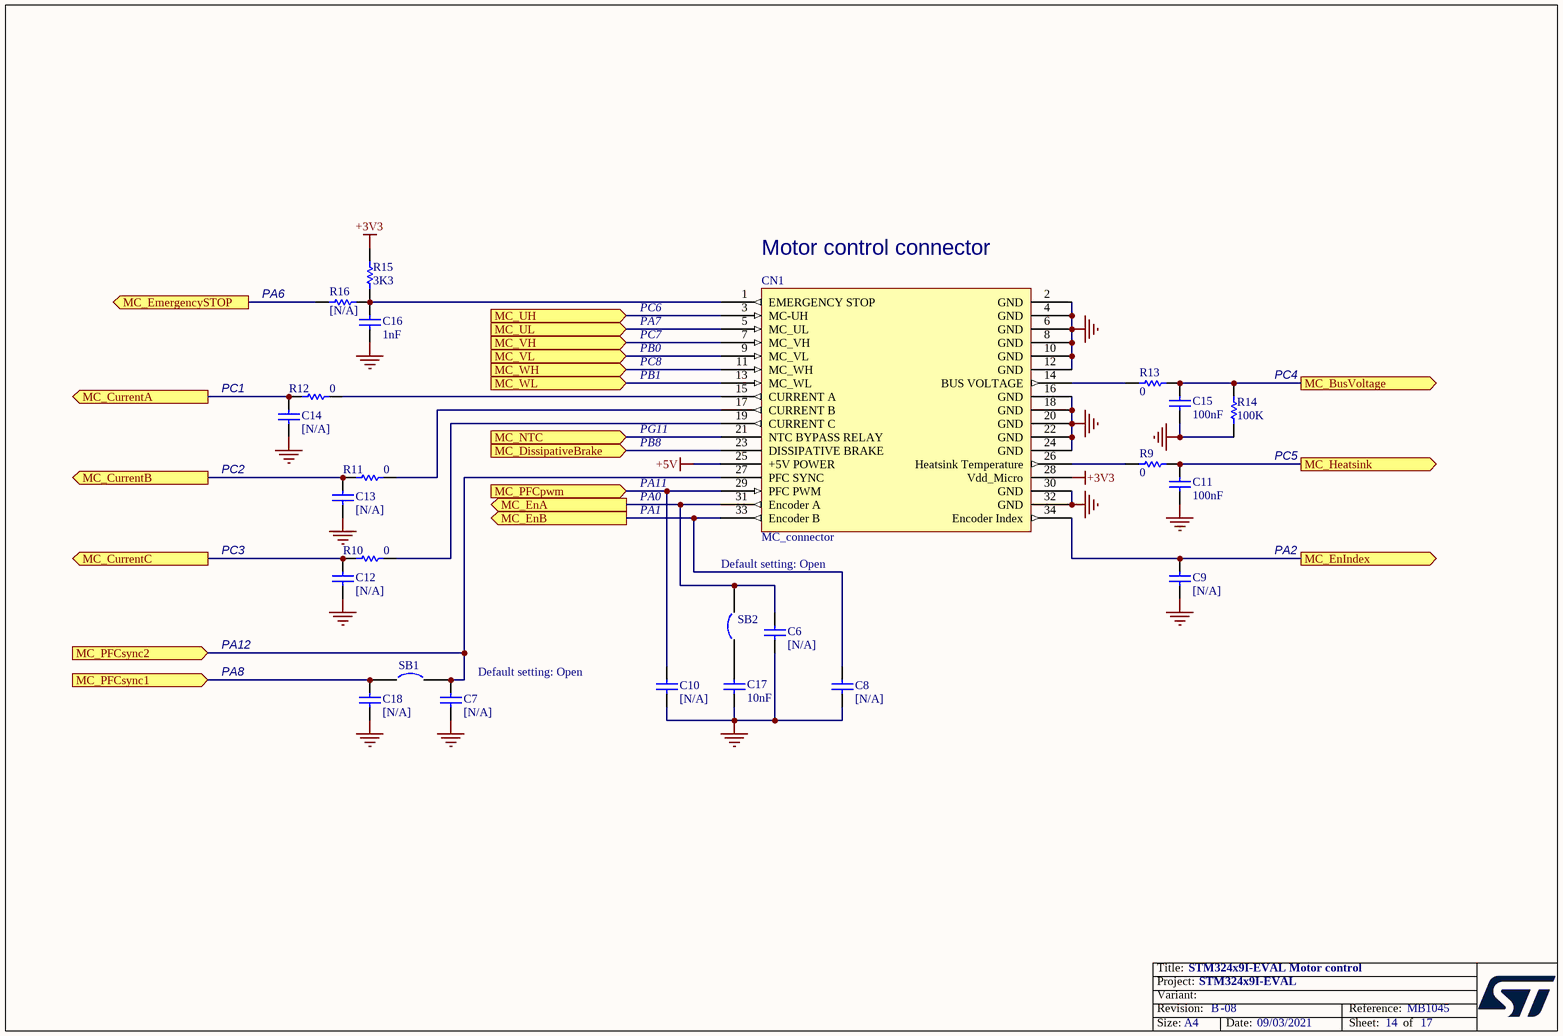
[diagram p5: MotorControl.SchDoc]

### Parts
C6  [N/A]  [0603C]
C7  [N/A]  [0603C]
C8  [N/A]  [0603C]
C9  [N/A]  [0603C]
C10  [N/A]  [0603C]
C11  100nF  [0603C]
C12  [N/A]  [0603C]
C13  [N/A]  [0603C]
C14  [N/A]  [0603C]
C15  100nF  [0603C]
C16  1nF  [0603C]
C17  10nF  [0603C]
C18  [N/A]  [0603C]
CN1  MC_connector  [IDC34S]
R9  0  [0603R]
R10  0  [0603R]
R11  0  [0603R]
R12  0  [0603R]
R13  0  [0603R]
R14  100K  [0603R]
R15  3K3  [0603R]
R16  [N/A]  [0603R]
SB1  (no value)  [JP2_SMD]
SB2  (no value)  [JP2_SMD]

### Ports
MC_BusVoltage (out), MC_CurrentA (out), MC_CurrentB (out), MC_CurrentC (out), MC_DissipativeBrake (in), MC_EmergencySTOP (out), MC_EnA (out), MC_EnB (out), MC_EnIndex (out), MC_Heatsink (out), MC_NTC (in), MC_PFCpwm (in), MC_PFCsync1 (in), MC_PFCsync2 (in), MC_UH (in), MC_UL (in), MC_VH (in), MC_VL (in), MC_WH (in), MC_WL (in)

### Nets
+3V3: CN1.28(Vdd_Micro) R15.2
+5V: CN1.25(+5V_POWER)
GND: C6.1 C7.1 C8.1 C9.1 C10.1 C11.2 C12.1 C13.1 C14.1 C15.2 C16.1 C17.2 C18.1 CN1.2(GND) CN1.4(GND) CN1.6(GND) CN1.8(GND) CN1.10(GND) CN1.12(GND) CN1.16(GND) CN1.18(GND) CN1.20(GND) CN1.22(GND) CN1.24(GND) CN1.30(GND) CN1.32(GND) R14.2
PA6: R16.2 ; port MC_EmergencySTOP
PAR_D1: CN1.7(MC_VH) ; port MC_VH
NetC6_2: C6.2 CN1.31(Encoder_A) SB2.2 ; port MC_EnA
NetC7_2: C7.2 CN1.27(PFC_SYNC) SB1.2 ; port MC_PFCsync2
NetC8_2: C8.2 CN1.33(Encoder_B) ; port MC_EnB
NetC9_2: C9.2 CN1.34(Encoder_Index) ; port MC_EnIndex
NetC10_2: C10.2 CN1.29(PFC_PWM) ; port MC_PFCpwm
NetC11_1: C11.1 R9.2 ; port MC_Heatsink
NetC12_2: C12.2 R10.1 ; port MC_CurrentC
NetC13_2: C13.2 R11.1 ; port MC_CurrentB
NetC14_2: C14.2 R12.1 ; port MC_CurrentA
NetC15_1: C15.1 R13.2 R14.1 ; port MC_BusVoltage
NetC16_2: C16.2 CN1.1(EMERGENCY_STOP) R15.1 R16.1
NetC17_1: C17.1 SB2.1
NetC18_2: C18.2 SB1.1 ; port MC_PFCsync1
NetCN1_3: CN1.3(MC-UH) ; port MC_UH
NetCN1_5: CN1.5(MC_UL) ; port MC_UL
NetCN1_9: CN1.9(MC_VL) ; port MC_VL
NetCN1_11: CN1.11(MC_WH) ; port MC_WH
NetCN1_13: CN1.13(MC_WL) ; port MC_WL
NetCN1_14: CN1.14(BUS_VOLTAGE) R13.1
NetCN1_15: CN1.15(CURRENT_A) R12.2
NetCN1_17: CN1.17(CURRENT_B) R11.2
NetCN1_19: CN1.19(CURRENT_C) R10.2
NetCN1_21: CN1.21(NTC_BYPASS_RELAY) ; port MC_NTC
NetCN1_23: CN1.23(DISSIPATIVE_BRAKE) ; port MC_DissipativeBrake
NetCN1_26: CN1.26(Heatsink_Temperature) R9.1

### Notes on the sheet
- (near R16) PA6
- PC6
- (near CN1) Motor control connector
- PA7
- PB0
- PB1
- PC7
- PC8
- (near R14) PC4
- PC1
- PG11
- PB8
- PC2
- PA1
- PA0
- PA11
- (near R14) PC5
- PC3
- Default setting: Open
- PA2
- PA12
- PA8
- (near C7) Default setting: Open
- Title:
- Project:
- Size:
- Revision:
- Variant:
- A4
- -
- Date:
- Reference:
- Sheet:
- of

### Library data of the parts
C6-C10 C12-C14 C18 = cap: Capacitor; Value: 100pF; Published: 8-Jun-2000; Revision: July-2002: Re-released for DXP Platform.; Publisher: Altium Limited
C11 C15 = Cap: Capacitor; Value: 10nF; Published: 8-Jun-2000; Revision: July-2002: Re-released for DXP Platform.; Publisher: Altium Limited
C16 C17 = CAP: Capacitor; Value: 100pF; Published: 8-Jun-2000; Revision: July-2002: Re-released for DXP Platform.; Publisher: Altium Limited
R9-R13 R15 R16 = Res1: Resistor; Value: 1K; Published: 8-Jun-2000; Revision: July-2002: Re-released for DXP Platform.; Publisher: Altium Limited
R14 = res1: Resistor; Value: 1K; Published: 8-Jun-2000; Revision: July-2002: Re-released for DXP Platform.; Publisher: Altium Limited
SB1 SB2 = Circuit Breaker: Published: 24-Mar-1999; Revision: July-2002: Re-released for DXP Platform.; Publisher: Altium Limited

## Nets that join several sheets
+3V3: MCU (JP8.1 R22.2 SW1.1 SW2.1), Ethernet (23 pins), USB_OTG (15 pins), RS232&IrDA (8 pins), CAN&MicroSDD&IO_Expandor (17 pins), MotorControl (CN1.28 R15.2)
+5V: USB_OTG (U6.5), MotorControl (CN1.25)
GND: MCU (64 pins), Ethernet (20 pins), USB_OTG (38 pins), RS232&IrDA (14 pins), CAN&MicroSDD&IO_Expandor (18 pins), MotorControl (27 pins)
VBUS_FS2: MCU (R264.1), USB_OTG (CN15.1 D6.B3 R83.1 R137.1)
NetC6_2: MCU (R223.2), MotorControl (C6.2 CN1.31 SB2.2)
NetC7_2: MCU (R252.2), MotorControl (C7.2 CN1.27 SB1.2)
NetC8_2: MCU (R210.2), MotorControl (C8.2 CN1.33)
NetC9_2: MCU (R215.2), MotorControl (C9.2 CN1.34)
NetC10_2: MCU (R255.2), MotorControl (C10.2 CN1.29)
NetC11_1: MCU (R263.1), MotorControl (C11.1 R9.2)
NetC12_2: MCU (R242.1), MotorControl (C12.2 R10.1)
NetC13_2: MCU (R232.1), MotorControl (C13.2 R11.1)
NetC14_2: MCU (R218.1), MotorControl (C14.2 R12.1)
NetC15_1: MCU (R235.1), MotorControl (C15.1 R13.2 R14.1)
NetC18_2: MCU (R268.2), MotorControl (C18.2 SB1.1)
NetCN1_3: MCU (R292.1), MotorControl (CN1.3)
NetCN1_5: MCU (R225.2), MotorControl (CN1.5)
NetCN1_9: MCU (R282.1), MotorControl (CN1.9)
NetCN1_11: MCU (R280.1), MotorControl (CN1.11)
NetCN1_13: MCU (R234.1), MotorControl (CN1.13)
NetCN1_21: MCU (R246.2), MotorControl (CN1.21)
NetCN1_23: MCU (R240.1), MotorControl (CN1.23)
NetCN15_4: MCU (R260.1), USB_OTG (CN15.4 D6.A3)
NetCN17_1: MCU (R293.1), CAN&MicroSDD&IO_Expandor (CN17.1 R156.2)
NetCN17_2: MCU (R284.1), CAN&MicroSDD&IO_Expandor (CN17.2 R155.2)
NetCN17_3: MCU (R294.1), CAN&MicroSDD&IO_Expandor (CN17.3 R154.2)
NetCN17_7: MCU (R281.1), CAN&MicroSDD&IO_Expandor (CN17.7 R153.2)
NetCN17_8: MCU (R265.1), CAN&MicroSDD&IO_Expandor (CN17.8 R152.2)
NetJP6_3: MCU (R279.2), Ethernet (JP6.3)
NetJP16_2: MCU (JP16.2), CAN&MicroSDD&IO_Expandor (U14.4)
NetR43_1: MCU (R43.1), Ethernet (U5.41)
NetR48_2: MCU (R267.1), Ethernet (R48.2)
NetR49_2: MCU (R239.1), Ethernet (R49.2)
NetR50_2: MCU (R227.2), Ethernet (R50.2)
NetR51_2: MCU (R214.2), Ethernet (R51.2)
NetR63_2: MCU (R238.1), Ethernet (R63.2)
NetR75_1: MCU (R211.2), Ethernet (R75.1 U5.30)
NetR222_1: MCU (R222.1), Ethernet (U5.31)
NetR228_1: MCU (R228.1), Ethernet (U5.5)
NetR233_2: MCU (R233.2), Ethernet (U5.3)
NetR236_2: MCU (R236.2), Ethernet (U5.4)
NetR243_1: MCU (R243.1), Ethernet (U5.6)
NetR249_2: MCU (R249.2), Ethernet (U5.2)
NetR256_2: MCU (R256.2), CAN&MicroSDD&IO_Expandor (U14.1)
NetR262_2: MCU (R262.2), RS232&IrDA (U1.3 U4.13)
NetSB7_1: MCU (SB7.1), Ethernet (U5.40)
NetSB8_2: MCU (SB8.2), Ethernet (U5.42)
PA3: MCU (U3.R2), USB_OTG (U7.24)
PA5: MCU (U3.P4), USB_OTG (R126.2)
PA6: MCU (U3.P3), MotorControl (R16.2)
PA10: MCU (U3.D15), RS232&IrDA (JP7.2)
PAR_D1: MCU (R45.1 U3.G15), MotorControl (CN1.7)
PAR_D9: MCU (U3.A12), CAN&MicroSDD&IO_Expandor (CN17.5)
PB0: MCU (R282.2 U3.R5), USB_OTG (R102.2)
PB1: MCU (R234.2 U3.R4), USB_OTG (R104.2)
PB5: MCU (U3.A8), USB_OTG (U7.17)
PB6: MCU (U3.B6), CAN&MicroSDD&IO_Expandor (U16.19)
PB9: MCU (U3.B4), CAN&MicroSDD&IO_Expandor (U16.20)
PB10: MCU (U3.P12), USB_OTG (U7.21)
PB11: MCU (U3.R13), USB_OTG (U7.20)
PB12: MCU (R260.2 U3.L13), USB_OTG (R108.2)
PB13: MCU (R264.2 U3.K14), USB_OTG (R112.2)
PB14: MCU (U3.R14), USB_OTG (D6.D3 R302.2)
PB15: MCU (U3.R15), USB_OTG (D6.C3 R300.2)
PC0: MCU (U3.M2), USB_OTG (U7.13)
PH4: MCU (U3.H4), USB_OTG (U7.11)
PH6: MCU (U3.P13), Ethernet (R47.2)
PH7: MCU (U3.N13), Ethernet (R46.2)
PI11: MCU (U3.F3), USB_OTG (U7.12)
RESET#: MCU (B1.2 B1.3 C91.2 U3.J1), Ethernet (U5.29), USB_OTG (R123.2)

## Assembly variants
F429NIH6: not fitted C6 C7 C8 C9 C10 C12 C13 C14 C18 C24 C25 C26 C79 C87 C92 C102 C124 CN19 CN25 D13 R16 R21 R43 R82 R83 R95 R107 R113 R119 R136 R138 R139 R140 R142 R144 R145 R160 R165 R166 R177 R179 R185 R210 R212 R215 R218 R220 R223 R225 R232 R234 R235 R240 R242 R246 R252 R255 R260 R263 R264 R268 R280 R282 R283 R292 SB1 SB2 SB3 SB4 SB5 SB6 SB7 SB8